# EAGLE design Laser_Teensy_No_AudShield (EAGLE 9.6.2)

## Sheet 1 of 3
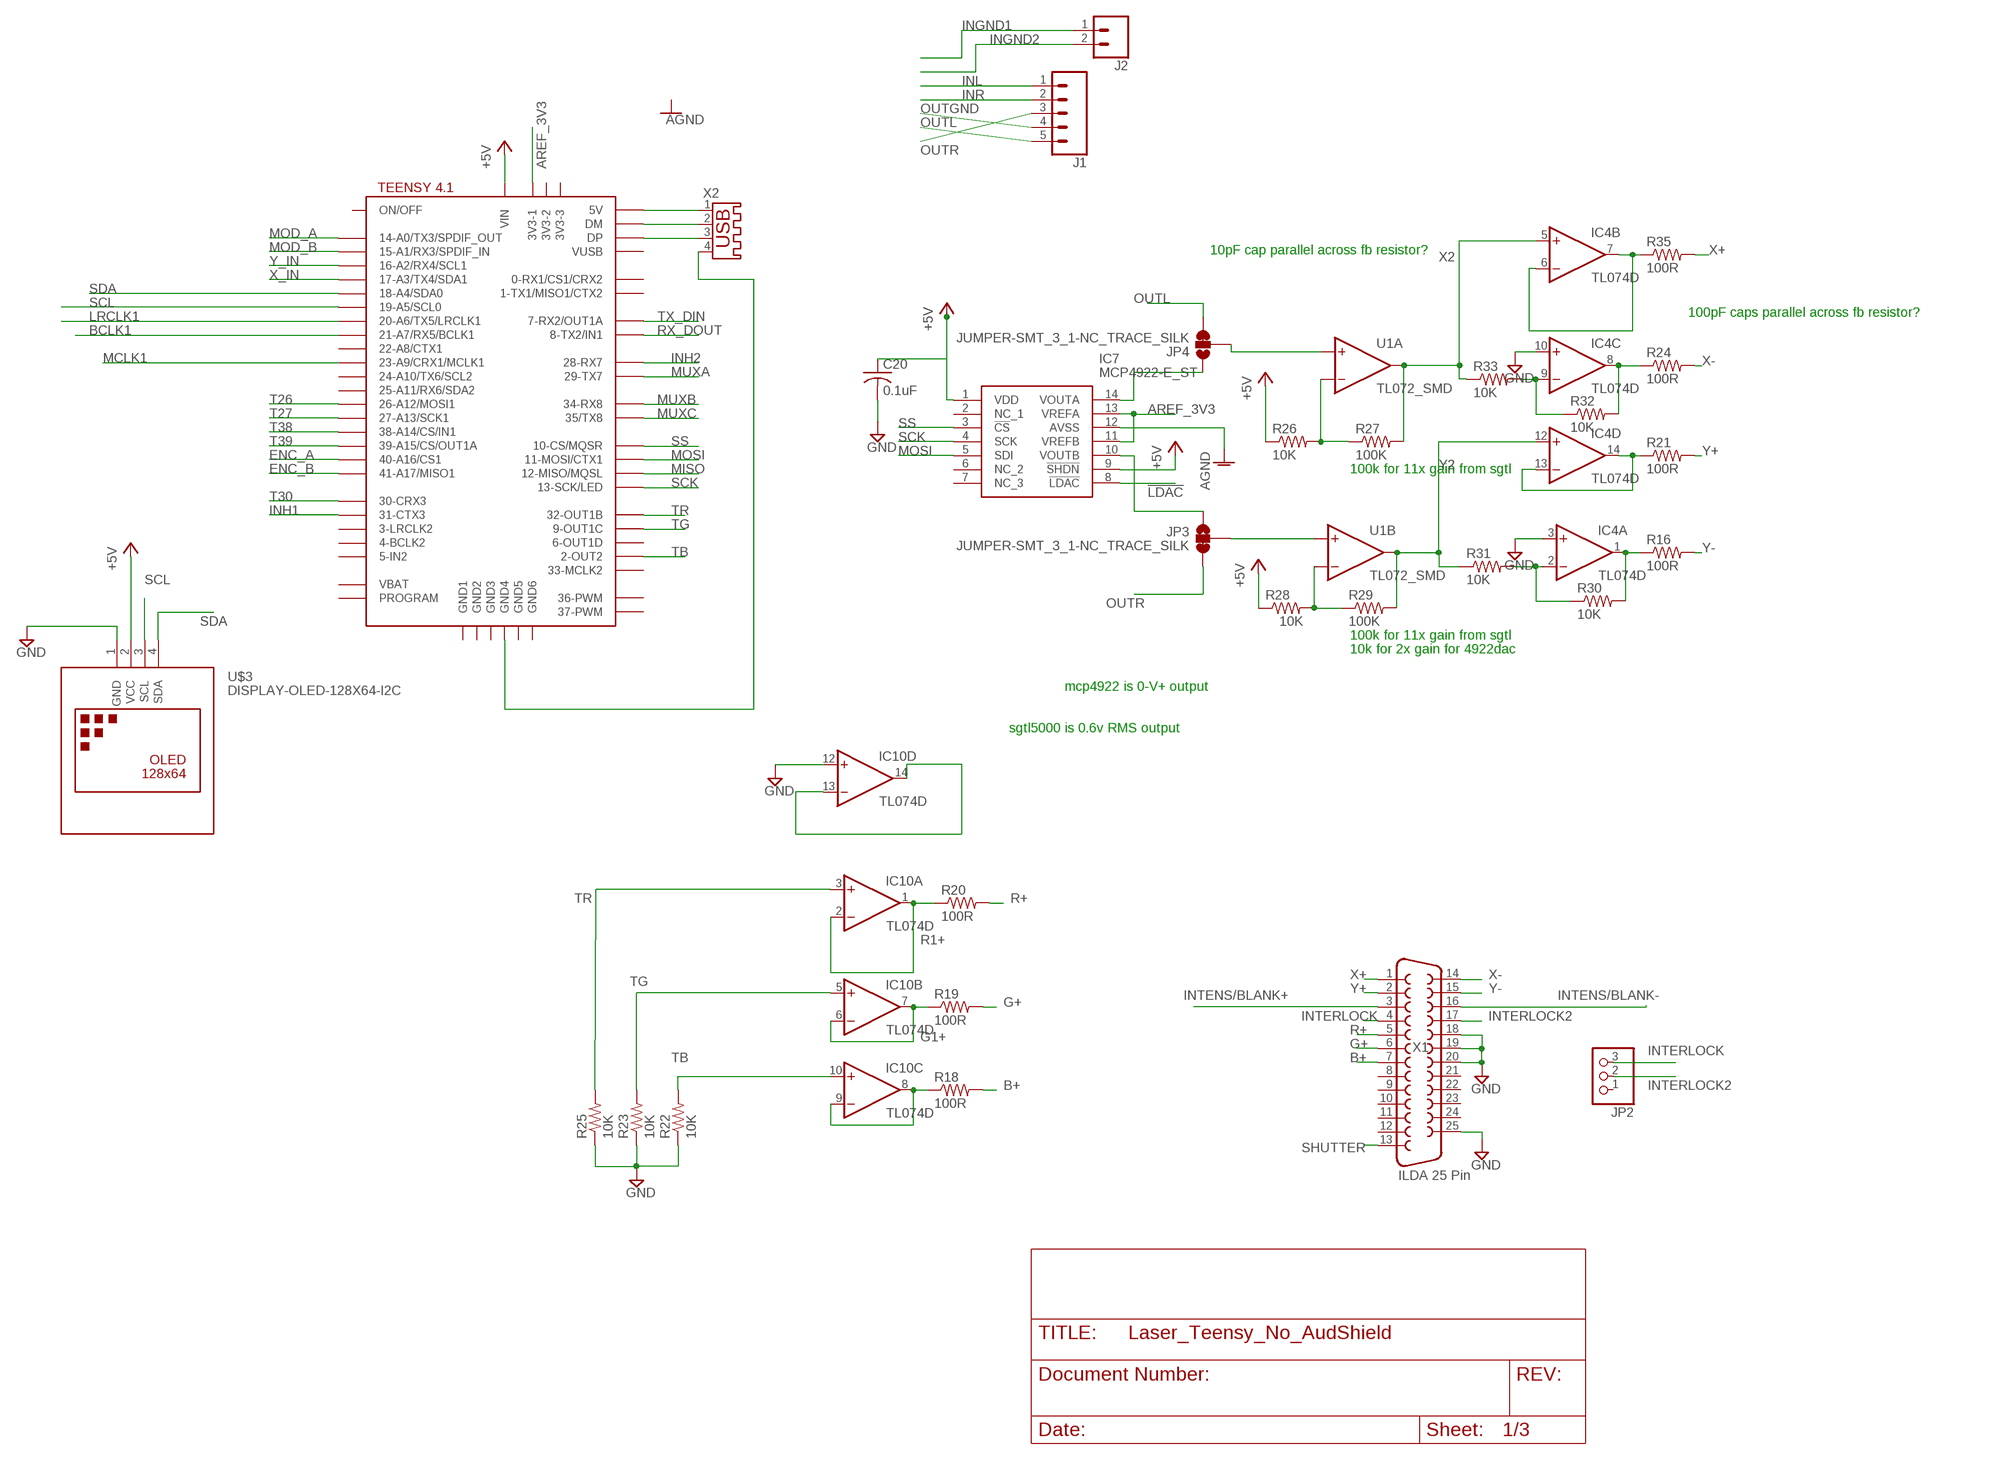
[diagram p0: schematic, sheet 1]

### Parts
C20  0.1uF  C-USC0603  [C0603]
IC4  TL074D  [SO14]
IC7  MCP4922-E_ST  [SOP65P638X110-14N]
IC10  TL074D  [SO14]
J1  CONN_05  [1X05]
J2  CONN_02  [1X02]
JP2  PINHD-1X3  [1X03]
JP3  JUMPER-SMT_3_1-NC_TRACE_SILK  [SMT-JUMPER_3_1-NC_TRACE_SILK]
JP4  JUMPER-SMT_3_1-NC_TRACE_SILK  [SMT-JUMPER_3_1-NC_TRACE_SILK]
R16  100R  R-US_R0603  [R0603]
R18  100R  R-US_R0603  [R0603]
R19  100R  R-US_R0603  [R0603]
R20  100R  R-US_R0603  [R0603]
R21  100R  R-US_R0603  [R0603]
R22  10K  R-US_R0603  [R0603]
R23  10K  R-US_R0603  [R0603]
R24  100R  R-US_R0603  [R0603]
R25  10K  R-US_R0603  [R0603]
R26  10K  R-US_R0603  [R0603]
R27  100K  R-US_R0603  [R0603]
R28  10K  R-US_R0603  [R0603]
R29  100K  R-US_R0603  [R0603]
R30  10K  R-US_R0603  [R0603]
R31  10K  R-US_R0603  [R0603]
R32  10K  R-US_R0603  [R0603]
R33  10K  R-US_R0603  [R0603]
R35  100R  R-US_R0603  [R0603]
U1  TL072_SMD  [SO08]
U$2  TEENSY41-E  [TENNSY41-E]
U$3  DISPLAY-OLED-128X64-I2C  [DISPLAY-OLED-128X64-I2C]
X1  ILDA 25 Pin  F25D  [F25D]
X2  USB-A003  [USB-A003]

### Nets
!LDAC: IC7.8(!LDAC)
+5V [power]: C20.1 IC7.1(VDD) IC7.9(!SHDN) R26.1 R28.1 U$2.VIN U$3.2(VCC) ; also sheet 2,3
AGND: IC7.12(AVSS)
AREF_3V3: IC7.11(VREFB) IC7.13(VREFA) U$2.3V3-1
B1+1: IC10.8(C:OUT) IC10.9(C:-IN) R18.1
B+: R18.2 X1.7
BCLK1: U$2.21-A7/RX5/BCLK1
ENC_A: U$2.40-A16/CS1 ; also sheet 2
ENC_B: U$2.41-A17/MISO1 ; also sheet 2
G1+: IC10.6(B:-IN) IC10.7(B:OUT) R19.1
G+: R19.2 X1.6
GND: C20.2 IC4.3(A:+IN) IC4.10(C:+IN) IC10.12(D:+IN) R22.1 R23.1 R25.1 U$3.1(GND) X1.18 X1.19 X1.20 X1.25 ; also sheet 2,3
INGND1: J2.1
INGND2: J2.2
INH1: U$2.31-CTX3 ; also sheet 2
INH2: U$2.28-RX7 ; also sheet 2
INL: J1.1
INR: J1.2
INTENS/BLANK+: X1.3
INTENS/BLANK-: X1.16
INTERLOCK: JP2.3 X1.4
INTERLOCK2: JP2.2 X1.17
LRCLK1: U$2.20-A6/TX5/LRCLK1
MCLK1: U$2.23-A9/CRX1/MCLK1
MISO: U$2.12-MISO/MQSL
MOD_A: U$2.14-A0/TX3/SPDIF_OUT ; also sheet 2
MOD_B: U$2.15-A1/RX3/SPDIF_IN ; also sheet 2
MOSI: IC7.5(SDI) U$2.11-MOSI/CTX1
MUXA: U$2.29-TX7 ; also sheet 2
MUXB: U$2.34-RX8 ; also sheet 2
MUXC: U$2.35-TX8(35/TX8) ; also sheet 2
N$1: IC7.14(VOUTA) JP4.1
N$2: IC7.10(VOUTB) JP3.1
N$3: U$2.+5V(5V) X2.1
N$4: U$2.DM X2.2
N$5: U$2.DP X2.3
N$12: U$2.GND4 X2.4
N$13: IC10.13(D:-IN) IC10.14(D:OUT)
N$17: JP3.2 U1.5(B:+IN)
N$18: JP4.2 U1.3(A:+IN)
N$30: R26.2 R27.1 U1.2(A:-IN)
N$31: R28.2 R29.1 U1.6(B:-IN)
N$35: IC4.9(C:-IN) R32.1 R33.2
N$36: IC4.2(A:-IN) R30.1 R31.2
OUTGND: J1.4
OUTL: J1.5 JP4.3
OUTR: J1.3 JP3.3
R1+: IC10.1(A:OUT) IC10.2(A:-IN) R20.1
R+: R20.2 X1.5
RX_DOUT: U$2.8-TX2/IN1
SCK: IC7.4(SCK) U$2.13-SCK/LED
SCL: U$2.19-A5/SCL0 U$3.3(SCL)
SDA: U$2.18-A4/SDA0 U$3.4(SDA)
SHUTTER: X1.13
SS: IC7.3(!CS) U$2.10-CS\MQSR(10-CS/MQSR)
T26: U$2.26-A12/MOSI1 ; also sheet 2
T27: U$2.27-A13/SCK1 ; also sheet 2
T30: U$2.30-CRX3
T38: U$2.38-A14/CS/IN1 ; also sheet 2
T39: U$2.39-A15/CS/OUT1A ; also sheet 2
TB: IC10.10(C:+IN) R22.2 U$2.2-OUT2
TG: IC10.5(B:+IN) R23.2 U$2.9-OUT1C
TR: IC10.3(A:+IN) R25.2 U$2.32-OUT1B
TX_DIN: U$2.7-RX2/OUT1A
X1+: IC4.6(B:-IN) IC4.7(B:OUT) R35.1
X1-: IC4.8(C:OUT) R24.1 R32.2
X2: IC4.5(B:+IN) R27.2 R33.1 U1.1(A:OUT)
X+: R35.2 X1.1
X-: R24.2 X1.14
X_IN: U$2.17-A3/TX4/SDA1 ; also sheet 2
Y1+: IC4.13(D:-IN) IC4.14(D:OUT) R21.1
Y1-: IC4.1(A:OUT) R16.1 R30.2
Y2: IC4.12(D:+IN) R29.2 R31.1 U1.7(B:OUT)
Y+: R21.2 X1.2
Y-: R16.2 X1.15
Y_IN: U$2.16-A2/RX4/SCL1 ; also sheet 2
Unconnected: IC7.2(NC_1) IC7.6(NC_2) IC7.7(NC_3) JP2.1 U$2.0-RX1/CS1/CRX2 U$2.1-TX1/MISO1/CTX2 U$2.3-LRCLK2 U$2.3V3-2 U$2.3V3-3 U$2.4-BCLK2 U$2.5-IN2 U$2.6-OUT1D U$2.22-A8/CTX1 U$2.24-A10/TX6/SCL2 U$2.25-A11/RX6/SDA2 U$2.33-MCLK2 U$2.36-PWM U$2.37-PWM U$2.GND1 U$2.GND2 U$2.GND3 U$2.GND5 U$2.GND6 U$2.ON/OFF U$2.PROGRAM U$2.VBAT U$2.VUSB X1.8 X1.9 X1.10 X1.11 X1.12 X1.21 X1.22 X1.23 X1.24

### Notes on the sheet
- 10pF cap parallel across fb resistor?
- 100pF caps parallel across fb resistor?
- 100k for 11x gain from sgtl
- 100k for 11x gain from sgtl
- 10k for 2x gain for 4922dac
- mcp4922 is 0-V+ output
- sgtl5000 is 0.6v RMS output

## Sheet 2 of 3
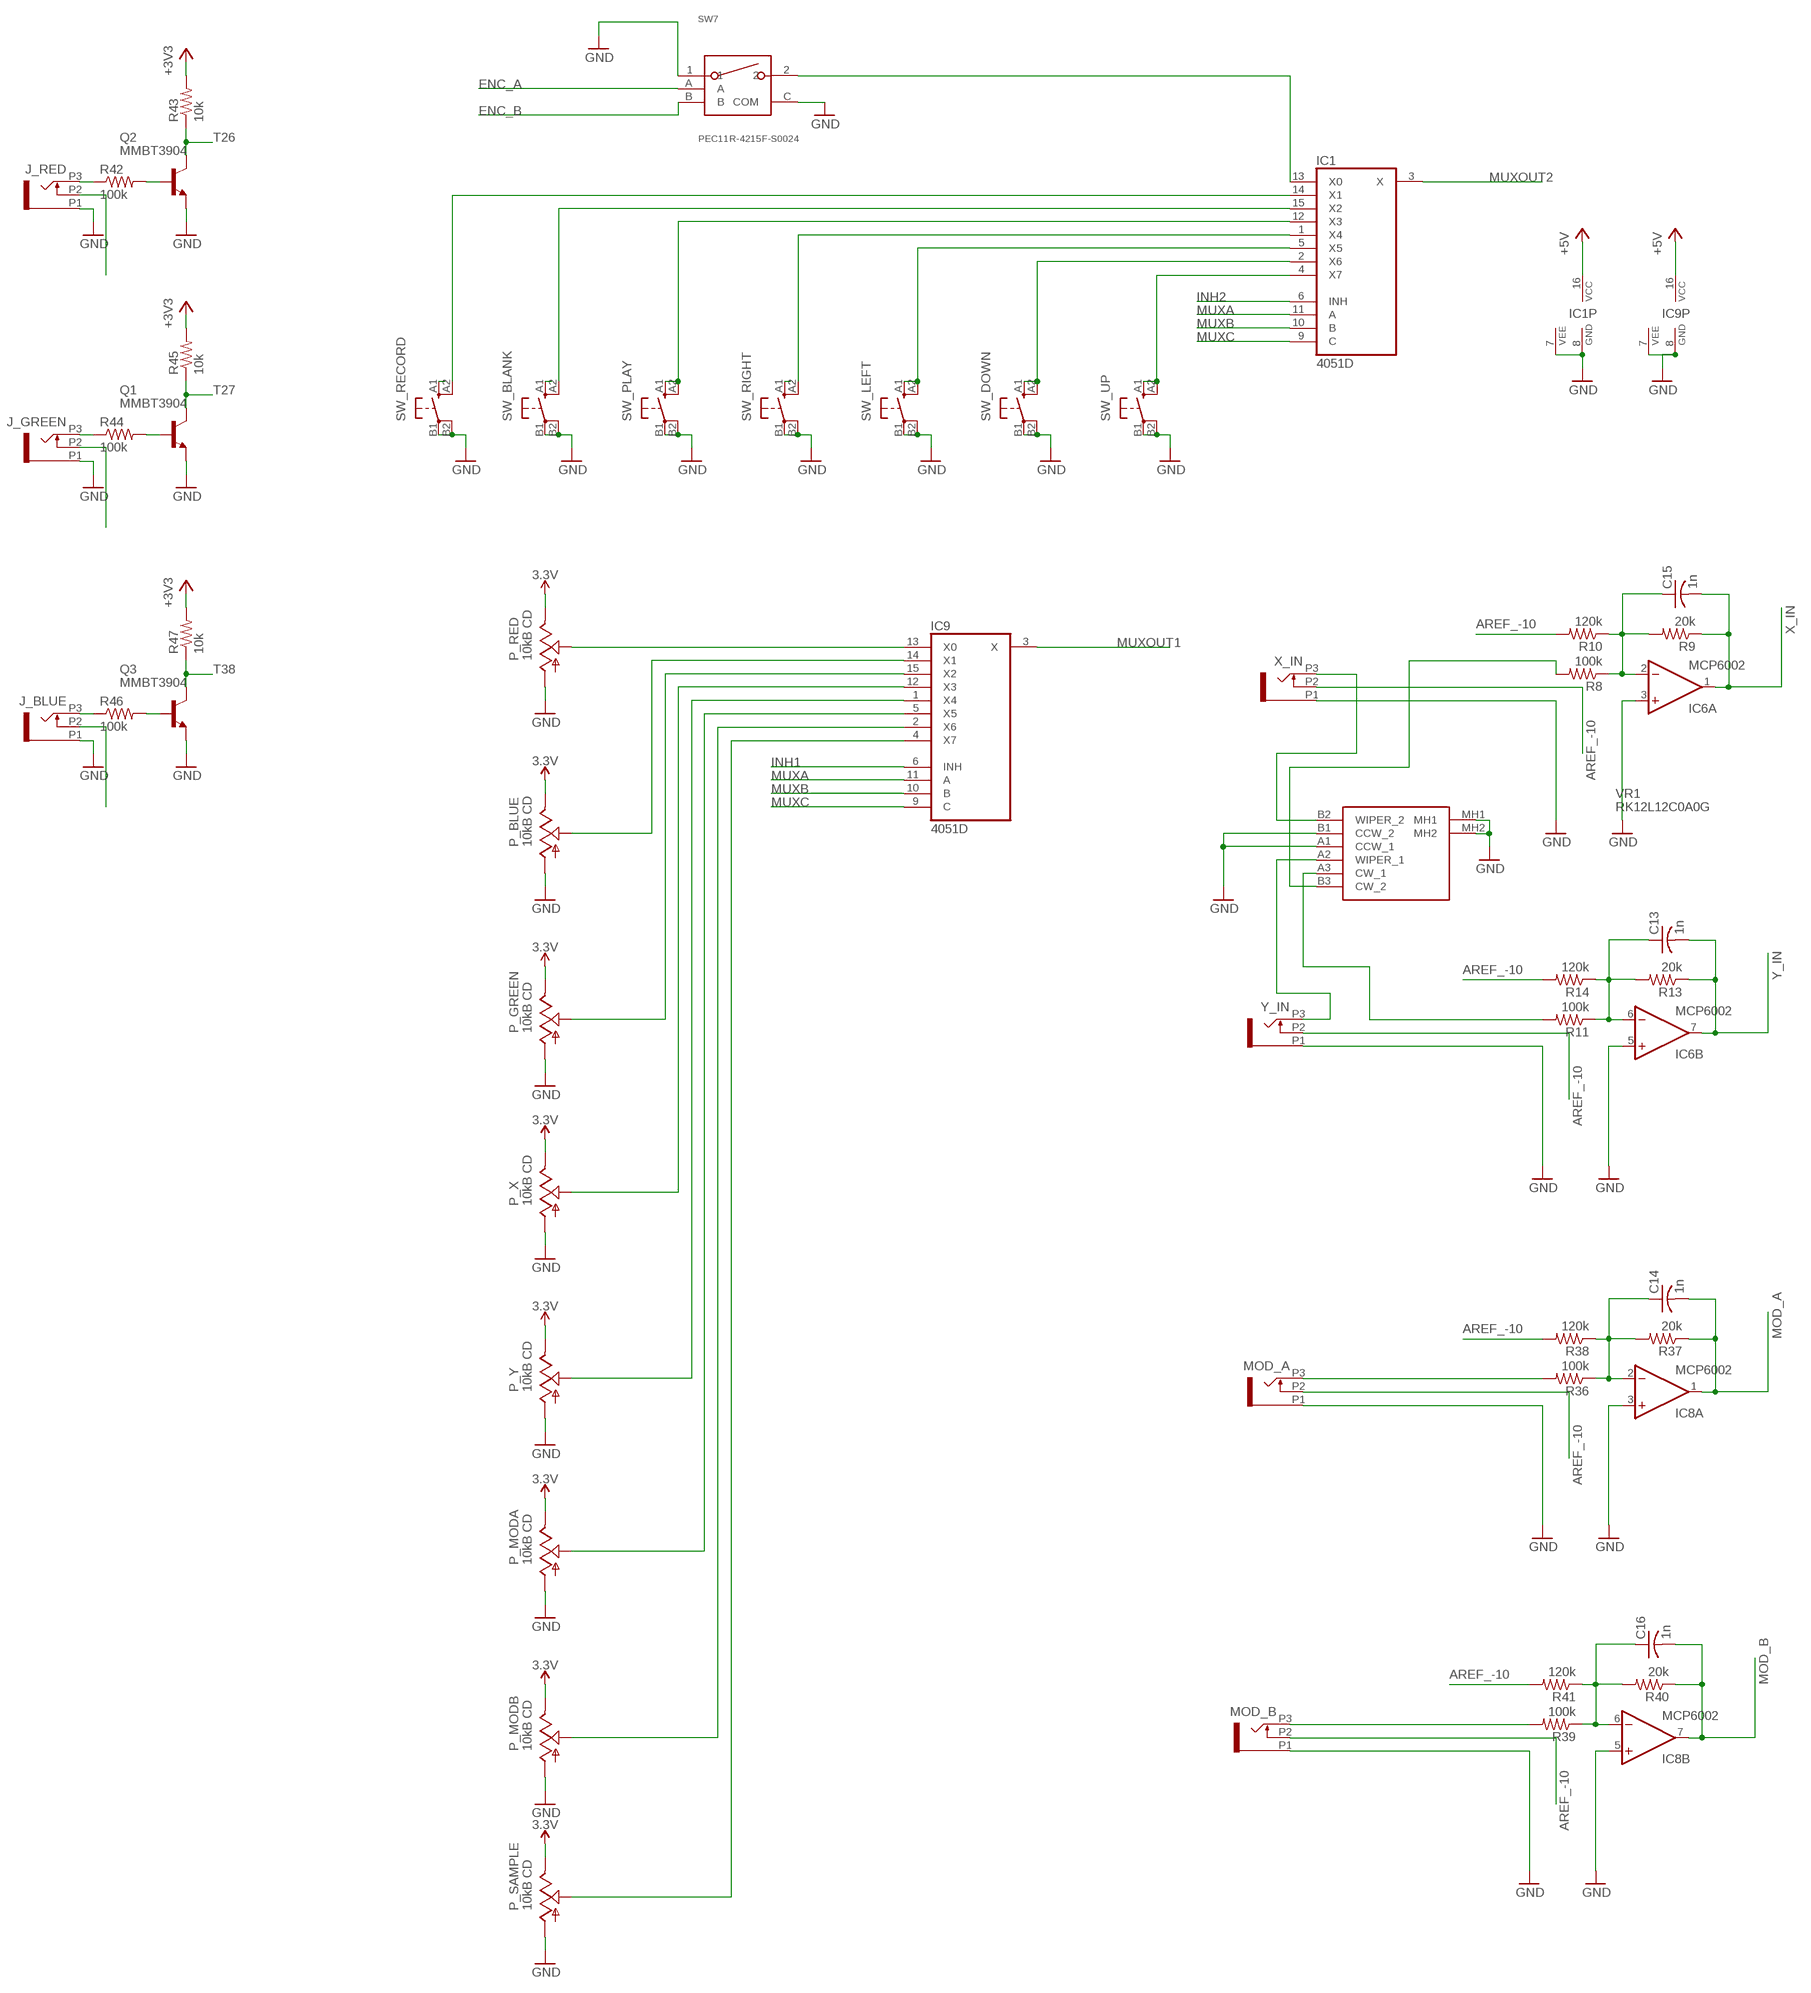
[diagram p1: schematic, sheet 2]

### Parts
C13  1n  C-US050-025X075  [C050-025X075]
C14  1n  C-US050-025X075  [C050-025X075]
C15  1n  C-US050-025X075  [C050-025X075]
C16  1n  C-US050-025X075  [C050-025X075]
IC1  4051D  [SO16]
IC6  MCP6002  TL072D  [SO08]
IC8  MCP6002  TL072D  [SO08]
IC9  4051D  [SO16]
J_BLUE  PJ301_THONKICONN6  [WQP_PJ_301M6]
J_GREEN  PJ301_THONKICONN6  [WQP_PJ_301M6]
J_RED  PJ301_THONKICONN6  [WQP_PJ_301M6]
MOD_A  PJ301_THONKICONN6  [WQP_PJ_301M6]
MOD_B  PJ301_THONKICONN6  [WQP_PJ_301M6]
P_BLUE  10kB CD  POT_USVERTICAL_PS  [ALPS_POT_VERTICAL_PS]
P_GREEN  10kB CD  POT_USVERTICAL_PS  [ALPS_POT_VERTICAL_PS]
P_MODA  10kB CD  POT_USVERTICAL_PS  [ALPS_POT_VERTICAL_PS]
P_MODB  10kB CD  POT_USVERTICAL_PS  [ALPS_POT_VERTICAL_PS]
P_RED  10kB CD  POT_USVERTICAL_PS  [ALPS_POT_VERTICAL_PS]
P_SAMPLE  10kB CD  POT_USVERTICAL_PS  [ALPS_POT_VERTICAL_PS]
P_X  10kB CD  POT_USVERTICAL_PS  [ALPS_POT_VERTICAL_PS]
P_Y  10kB CD  POT_USVERTICAL_PS  [ALPS_POT_VERTICAL_PS]
Q1  MMBT3904  MMBT3904LT1-NPN-SOT23-BEC  [SOT23-BEC]
Q2  MMBT3904  MMBT3904LT1-NPN-SOT23-BEC  [SOT23-BEC]
Q3  MMBT3904  MMBT3904LT1-NPN-SOT23-BEC  [SOT23-BEC]
R8  100k  R-US_0204/7  [0204/7]
R9  20k  R-US_0204/7  [0204/7]
R10  120k  R-US_0204/7  [0204/7]
R11  100k  R-US_0204/7  [0204/7]
R13  20k  R-US_0204/7  [0204/7]
R14  120k  R-US_0204/7  [0204/7]
R36  100k  R-US_0204/7  [0204/7]
R37  20k  R-US_0204/7  [0204/7]
R38  120k  R-US_0204/7  [0204/7]
R39  100k  R-US_0204/7  [0204/7]
R40  20k  R-US_0204/7  [0204/7]
R41  120k  R-US_0204/7  [0204/7]
R42  100k  R-US_R0603  [R0603]
R43  10k  R-US_R0603  [R0603]
R44  100k  R-US_R0603  [R0603]
R45  10k  R-US_R0603  [R0603]
R46  100k  R-US_R0603  [R0603]
R47  10k  R-US_R0603  [R0603]
SW7  PEC11R-4215F-S0024  [PEC11R-4215F-S0024]
SW_BLANK  D6R  [D6R]
SW_DOWN  D6R  [D6R]
SW_LEFT  D6R  [D6R]
SW_PLAY  D6R  [D6R]
SW_RECORD  D6R  [D6R]
SW_RIGHT  D6R  [D6R]
SW_UP  D6R  [D6R]
VR1  RK12L12C0A0G  [RK12L12C0A0G]
X_IN  PJ301_THONKICONN6  [WQP_PJ_301M6]
Y_IN  PJ301_THONKICONN6  [WQP_PJ_301M6]

### Nets
3.3V [+3V3]: P_BLUE.P$1(E) P_GREEN.P$1(E) P_MODA.P$1(E) P_MODB.P$1(E) P_RED.P$1(E) P_SAMPLE.P$1(E) P_X.P$1(E) P_Y.P$1(E)
+3V3: R43.2 R45.2 R47.2 ; also sheet 3
+5V [power]: IC1.16(VCC) IC9.16(VCC) ; also sheet 1,3
AREF_-10 [-10V]: MOD_A.P2 MOD_B.P2 R10.2 R14.2 R38.2 R41.2 X_IN.P2 Y_IN.P2 ; also sheet 3
ENC_A: SW7.A ; also sheet 1
ENC_B: SW7.B ; also sheet 1
GND: IC1.7(VEE) IC1.8(GND) IC6.3(A:+IN) IC6.5(B:+IN) IC8.3(A:+IN) IC8.5(B:+IN) IC9.7(VEE) IC9.8(GND) J_BLUE.P1 J_GREEN.P1 J_RED.P1 MOD_A.P1 MOD_B.P1 P_BLUE.P$3(A) P_GREEN.P$3(A) P_MODA.P$3(A) P_MODB.P$3(A) P_RED.P$3(A) P_SAMPLE.P$3(A) P_X.P$3(A) P_Y.P$3(A) Q1.E Q2.E Q3.E SW7.1 SW7.C(COM) SW_BLANK.B2(P1) SW_DOWN.B1(P) SW_DOWN.B2(P1) SW_LEFT.B1(P) SW_LEFT.B2(P1) SW_PLAY.B1(P) SW_PLAY.B2(P1) SW_RECORD.B2(P1) SW_RIGHT.B2(P1) SW_UP.B1(P) SW_UP.B2(P1) VR1.A1(CCW_1) VR1.B1(CCW_2) VR1.MH1 VR1.MH2 X_IN.P1 Y_IN.P1 ; also sheet 1,3
INH1: IC9.6(INH) ; also sheet 1
INH2: IC1.6(INH) ; also sheet 1
MOD_A: C14.2 IC8.1(A:OUT) R37.1 ; also sheet 1
MOD_B: C16.2 IC8.7(B:OUT) R40.1 ; also sheet 1
MUXA: IC1.11(A) IC9.11(A) ; also sheet 1
MUXB: IC1.10(B) IC9.10(B) ; also sheet 1
MUXC: IC1.9(C) IC9.9(C) ; also sheet 1
MUXOUT1: IC9.3(X)
MUXOUT2: IC1.3(X)
N$6: C15.1 IC6.2(A:-IN) R8.1 R9.2 R10.1
N$9: VR1.B2(WIPER_2) X_IN.P3
N$11: C13.1 IC6.6(B:-IN) R11.1 R13.2 R14.1
N$14: C14.1 IC8.2(A:-IN) R36.1 R37.2 R38.1
N$15: R8.2 VR1.B3(CW_2)
N$19: SW_BLANK.A1(S)
N$21: SW_BLANK.B1(P)
N$22: IC9.13(X0) P_RED.P$2(S)
N$23: SW_RIGHT.B1(P)
N$24: IC9.14(X1) P_BLUE.P$2(S)
N$25: VR1.A2(WIPER_1) Y_IN.P3
N$26: IC1.1(X4) SW_RIGHT.A2(S1)
N$27: IC9.15(X2) P_GREEN.P$2(S)
N$28: IC1.15(X2) SW_BLANK.A2(S1)
N$29: IC9.12(X3) P_X.P$2(S)
N$32: IC9.1(X4) P_Y.P$2(S)
N$33: SW_RECORD.B1(P)
N$34: C16.1 IC8.6(B:-IN) R39.1 R40.2 R41.1
N$37: SW_RECORD.A1(S)
N$38: IC1.14(X1) SW_RECORD.A2(S1)
N$39: IC1.13(X0) SW7.2
N$40: IC9.5(X5) P_MODA.P$2(S)
N$41: IC9.2(X6) P_MODB.P$2(S)
N$42: IC9.4(X7) P_SAMPLE.P$2(S)
N$43: R11.2 VR1.A3(CW_1)
N$44: J_RED.P3 R42.1
N$45: MOD_A.P3 R36.2
N$46: MOD_B.P3 R39.2
N$47: J_RED.P2
N$48: Q1.B R44.2
N$49: J_GREEN.P3 R44.1
N$50: J_GREEN.P2
N$51: Q3.B R46.2
N$52: J_BLUE.P3 R46.1
N$53: J_BLUE.P2
N$66: Q2.B R42.2
T26: Q2.C R43.1 ; also sheet 1
T27: Q1.C R45.1 ; also sheet 1
T38: IC1.2(X6) IC1.12(X3) Q3.C R47.1 SW_DOWN.A1(S) SW_DOWN.A2(S1) SW_PLAY.A1(S) SW_PLAY.A2(S1) ; also sheet 1
T39: IC1.4(X7) IC1.5(X5) SW_LEFT.A1(S) SW_LEFT.A2(S1) SW_RIGHT.A1(S) SW_UP.A1(S) SW_UP.A2(S1) ; also sheet 1
X_IN: C15.2 IC6.1(A:OUT) R9.1 ; also sheet 1
Y_IN: C13.2 IC6.7(B:OUT) R13.1 ; also sheet 1

## Sheet 3 of 3
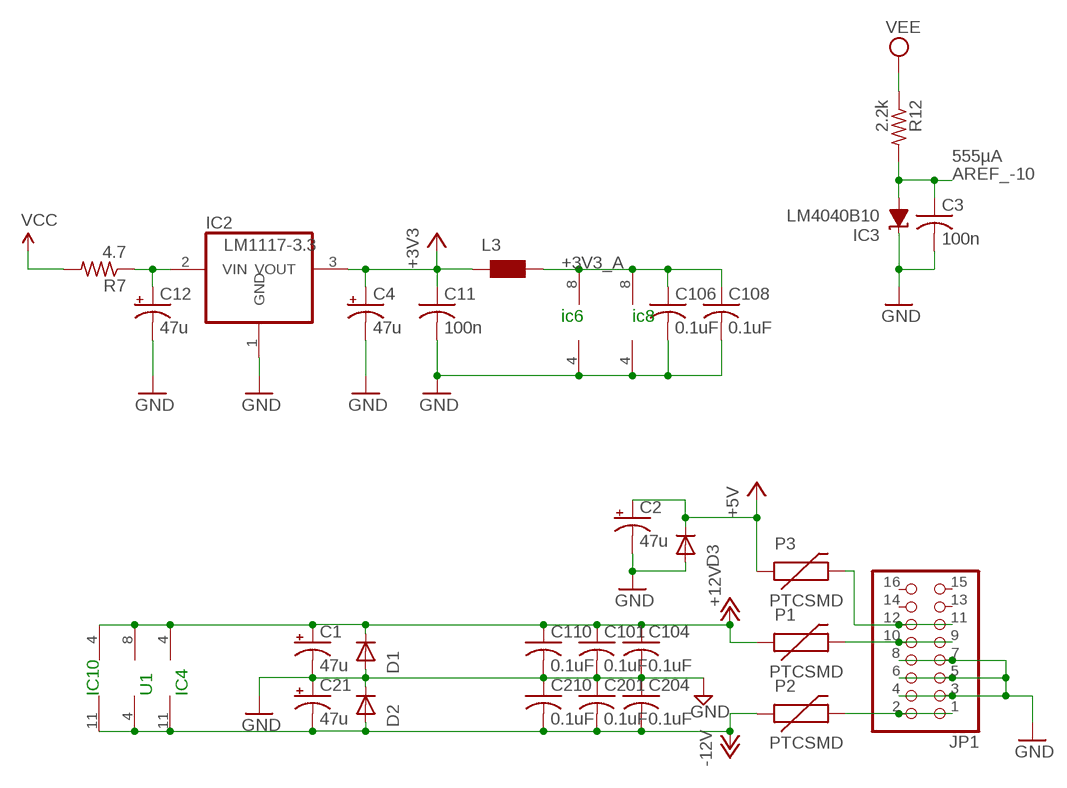
[diagram p2: schematic, sheet 3]

### Parts
C1  47u  CPOL-USD  [PANASONIC_D]
C2  47u  CPOL-USD  [PANASONIC_D]
C3  100n  C-USC0603  [C0603]
C4  47u  CPOL-USD  [PANASONIC_D]
C11  100n  C-USC0603  [C0603]
C12  47u  CPOL-USD  [PANASONIC_D]
C21  47u  CPOL-USD  [PANASONIC_D]
C101  0.1uF  C-USC0603  [C0603]
C104  0.1uF  C-USC0603  [C0603]
C106  0.1uF  C-USC0603  [C0603]
C108  0.1uF  C-USC0603  [C0603]
C110  0.1uF  C-USC0603  [C0603]
C201  0.1uF  C-USC0603  [C0603]
C204  0.1uF  C-USC0603  [C0603]
C210  0.1uF  C-USC0603  [C0603]
D1  1N5819HW  DIODE-SOD123  [SOD123]
D2  1N5819HW  DIODE-SOD123  [SOD123]
D3  1N5819HW  DIODE-SOD123  [SOD123]
IC2  LM1117-3.3  REG1117T  [TO252]
IC3  LM4040B10  LM4041B12DBZ  [DBZ_R-PDSO-G3]
JP1  PINHD-2X8  [2X08]
L3  WE-CBF_0603  [0603]
P1  PTCSMD  [PTC-1206]
P2  PTCSMD  [PTC-1206]
P3  PTCSMD  [PTC-1206]
R7  4.7  R-US_R1206  [R1206]
R12  2.2k  R-US_R0603  [R0603]

### Nets
+3V3: C4.+ C11.1 IC2.3(VOUT) L3.1 ; also sheet 2
+3V3_A: C106.1 C108.1 IC6.8(P:V+) IC8.8(P:V+) L3.2
+5V [power]: C2.+ D3.C P3.1 ; also sheet 1,2
+12V [power]: C1.+ C101.1 C104.1 C110.1 D1.C IC4.4(P:V+) IC10.4(P:V+) P1.1 U1.8(P:V+)
-12V [power]: C21.- C201.2 C204.2 C210.2 D2.A IC4.11(P:V-) IC10.11(P:V-) P2.1 U1.4(P:V-)
AREF_-10 [-10V]: C3.1 IC3.2(A) R12.2 ; also sheet 2
GND: C1.- C2.- C3.2 C4.- C11.2 C12.- C21.+ C101.2 C104.2 C106.2 C108.2 C110.2 C201.1 C204.1 C210.1 D1.A D2.C D3.A IC2.1(GND) IC3.1(C) IC6.4(P:V-) IC8.4(P:V-) JP1.3 JP1.4 JP1.5 JP1.6 JP1.7 JP1.8 ; also sheet 1,2
N$7: JP1.1 JP1.2 P2.2
N$8: JP1.9 JP1.10 P1.2
N$10: JP1.11 JP1.12 P3.2
N$16: C12.+ IC2.2(VIN) R7.1
VCC [VCC]: R7.2
VEE: R12.1
Unconnected: JP1.13 JP1.14 JP1.15 JP1.16

### Notes on the sheet
- 555µA
- ic6 | ic8
- IC10 | U1 | IC4

## Library data of the parts
C1 C2 C4 C12 C21 = rcl:CPOL-US: POLARIZED CAPACITOR, American symbol
C3 C11 = rcl:C-US: CAPACITOR, American symbol
C13-C16 = rcl:C-US: CAPACITOR, American symbol; SPICEPREFIX: C
C20 C101 C104 C106 C108 C110 C201 C204 C210 = adafruit:C-US: CAPACITOR, American symbol
D1-D3 = diode:DIODE-: DIODE
IC1 IC9 = 40xx:4051: 8-channel ANALOG MULTIPLEXER
IC2 = og-vreg:REG1117: 800mA and 1A Low Dropout (LDO) Positive Regulator 1.8V, 2.5V, 2.85V, 3.3V, 5V, and Adj
IC3 = texas:LM4041: PRECISION MICROPOWER SHUNT VOLTAGE REFERENCE Source: http://focus.ti.com/lit/ds/slcs146e/slcs146e.pdf
IC4 IC10 = linear:TL074: OP AMP
IC6 IC8 = linear:TL072: OP AMP
IC7 = SamacSys_Parts:MCP4922-E_ST: Microchip MCP4922-E/ST, 2-channel 12 bit Serial DAC, 14-Pin TSSOP Source: Datasheet <http://componentsearchengine.com/Datasheets/3/MCP4922-E_ST.pdf>; ARROW_PART_NUMBER: MCP4922-E/ST; ARROW_PRICE-STOCK: https://www.arrow.com/en/products/mcp4922-est/microchip-technology; DESCRIPTION: Microchip MCP4922-E/ST, 2-channel 12 bit Serial DAC, 14-Pin TSSOP; HEIGHT: 1.1mm; MANUFACTURER_NAME: Microchip; MANUFACTURER_PART_NUMBER: MCP4922-E/ST; MOUSER_PART_NUMBER: 579-MCP4922-E/ST; MOUSER_PRICE-STOCK: https://www.mouser.co.uk/ProductDetail/Microchip-Technology/MCP4922-E-ST?qs=iRhCjdSJZe6gRerFwLixKQ%3D%3D
J1 = SparkFun-Connectors:CONN_05: Multi connection point. Often used as Generic Header-pin footprint for 0.1 inch spaced/style header connections On any of the 0.1 inch spaced packages, you can populate with these: Break Away Headers - Straight <https://www.sparkfun.com/products/116> (PRT-00116) Break Away Male Headers - Right Angle <https://www.sparkfun.com/products/553> (PRT-00553) Female Headers <https://www.sparkfun.com/products/115> (PRT-00115) Break Away Headers - Machine Pin <https://www.sparkfun.com/products/117> (PRT-00117) Break Away Female Headers - Swiss Machine Pin <https://www.sparkfun.com/products/743> (PRT-00743) For SCREWTERMINALS and SPRING TERMINALS visit here: Screw Terimnals on SparkFun.com <https://www.sparkfun.com/search/results?term=Screw+Terminals> (5mm/3.5mm/2.54mm spacing) This device is also useful as a general connection point to wire up your design to another part of your project. Our various solder wires solder well into these plated through hole pads. Hook-Up Wire - Assortment (Stranded, 22 AWG) <https://www.sparkfun.com/products/11375> (PRT-11375) Hook-Up Wire - Assortment (Solid Core, 22 AWG) <https://www.sparkfun.com/products/11367> (PRT-11367) View the entire wire category on our website here <https://www.sparkfun.com/categories/141> Special notes: Molex polarized connector foot print use with SKU : PRT-08231 with associated crimp pins and housings. 1MM SMD Version SKU: PRT-10208
J2 = SparkFun-Connectors:CONN_02: Multi connection point. Often used as Generic Header-pin footprint for 0.1 inch spaced/style header connections On any of the 0.1 inch spaced packages, you can populate with these: Break Away Headers - Straight <https://www.sparkfun.com/products/116> (PRT-00116) Break Away Male Headers - Right Angle <https://www.sparkfun.com/products/553> (PRT-00553) Female Headers <https://www.sparkfun.com/products/115> (PRT-00115) Break Away Headers - Machine Pin <https://www.sparkfun.com/products/117> (PRT-00117) Break Away Female Headers - Swiss Machine Pin <https://www.sparkfun.com/products/743> (PRT-00743) For SCREWTERMINALS and SPRING TERMINALS visit here: Screw Terimnals on SparkFun.com <https://www.sparkfun.com/search/results?term=Screw+Terminals> (5mm/3.5mm/2.54mm spacing) This device is also useful as a general connection point to wire up your design to another part of your project. Our various solder wires solder well into these plated through hole pads. Hook-Up Wire - Assortment (Stranded, 22 AWG) <https://www.sparkfun.com/products/11375> (PRT-11375) Hook-Up Wire - Assortment (Solid Core, 22 AWG) <https://www.sparkfun.com/products/11367> (PRT-11367) View the entire wire category on our website here <https://www.sparkfun.com/categories/141> Special notes: Molex polarized connector foot print use with: PRT-08233 with associated crimp pins and housings. 2.54_SCREWTERM for use with PRT-10571. 3.5mm Screw Terminal footprints for PRT-08084 5mm Screw Terminal footprints for use with PRT-08432
J_BLUE J_GREEN J_RED = og-pj301:PJ301_THONKICONN
JP1 = pinhead:PINHD-2X8: PIN HEADER
JP2 = pinhead:PINHD-1X3: PIN HEADER
JP3 JP4 = SparkFun-Jumpers:JUMPER-SMT_3_1-NC_TRACE: Normally closed trace jumper (1 of 2 connections) This jumper has a trace between two pads so it's normally closed (NC). The other connection is normally open (NO). Use a razor knife to open the connection. For best results follow the IPC guidelines for cutting traces: Cutout at least 0.063 mm (0.005 in). Remove all loose material to clean up the cut area. Seal the cut with an approved epoxy. Reapply solder to reclose the connection, or to close the NO connection.
L3 = wuerth-elektronik:WE-CBF: SMD EMI Suppression Ferrite Beads - excellent anti-EMI properties - low DCR - impedances till 3000 ohms - rated current up to 6 A
MOD_A MOD_B X_IN Y_IN = og-pj301_variations:PJ301_THONKICONN
P1-P3 = SparkFun:PTC: Resettable Fuse PTC Resettable Fuse. Spark Fun Electronics SKU : COM-08357
P_BLUE P_GREEN P_MODA P_MODB P_RED P_SAMPLE P_X P_Y = pot-alps:POT_US
Q1-Q3 = transistor:*-NPN-: NPN Transistror BF959 corrected 2008.03.06
R7 R12 R42-R47 = rcl:R-US_: RESISTOR, American symbol
R8-R11 R13 R14 R36-R41 = rcl:R-US_: RESISTOR, American symbol; SPICEPREFIX: R
R16 R18-R33 R35 = resistor:R-US_: RESISTOR, American symbol
SW7 = Switch:PEC11R-4215F-S0024: ROTARY ENCODER MECHANICAL 24PPR Manufacturer's datasheet <https://www.bourns.com/docs/Product-Datasheets/PEC11R.pdf>; CREATED_BY: PCBLayout.com; DIGIKEY_PART_NUMBER: PEC11R-4215F-S0024-ND; MANUFACTURER: Bourns Inc.; MPN: PEC11R-4215F-S0024
SW_BLANK SW_DOWN SW_LEFT SW_PLAY SW_RECORD SW_RIGHT SW_UP = og-switch:D6R: C&K D6R
U1 = MusicThingModular:TL072: Generic Dual Op Amp
U$2 = teensy:TEENSY41-E
U$3 = diy-modules:DISPLAY-OLED-128X64-I2C: 128x64 Dot Matrix OLED Module based on SSD1306 chip Variant with I2C interface More details available here: http://www.instructables.com/id/Monochrome-096-i2c-OLED-display-with-arduino-SSD13/ SSD1306 datasheet: https://cdn-shop.adafruit.com/datasheets/SSD1306.pdf Click here to find device on ebay.com <http://www.ebay.com/sch/oled+display+128x64+iic> Note: There are two variants: I2C and SPI. Search for the proper version.
VR1 = SamacSys_Parts:RK12L12C0A0G: Alps Potentiometer RK12L Series with a 6 mm Dia. Shaft 10k +/-20%, Logarithmic, Through Hole Source: Datasheet <http://uk.rs-online.com/web/p/products/7293697P>; DESCRIPTION: Alps Potentiometer RK12L Series with a 6 mm Dia. Shaft 10k +/-20%, Logarithmic, Through Hole; HEIGHT: 15mm; MANUFACTURER_NAME: ALPS; MANUFACTURER_PART_NUMBER: RK12L12C0A0G; MOUSER_PART_NUMBER: 688-RK12L12C0A0G; MOUSER_PRICE-STOCK: https://www.mouser.co.uk/ProductDetail/ALPS/RK12L12C0A0G?qs=haWY0xvQGj%2FMhz6JhOHy%252BQ%3D%3D
X1 = SparkFun:F25: D-SUB 25 25 Pin male connector. PCB edge mount for regular PCB thicknesses. This connector will connect directly to the back of a PC parallel port or through a normal DB25 extension cable (M/F). SKU: PRT-08287
X2 = con-yamaichi:USB-A003: USB connector; OC_FARNELL: unknown; OC_NEWARK: unknown

## Net classes
1 power: width 0.305 mm, clearance 0.203 mm
2 +3V3: width 0.356 mm, clearance 0.152 mm to class 0, clearance 0.254 mm
3 -10V: width 0.356 mm, clearance 0.152 mm to class 0, clearance 0.254 mm
4 VCC: width 0.457 mm, clearance 0.152 mm to class 0, clearance 0.254 mm

## Board
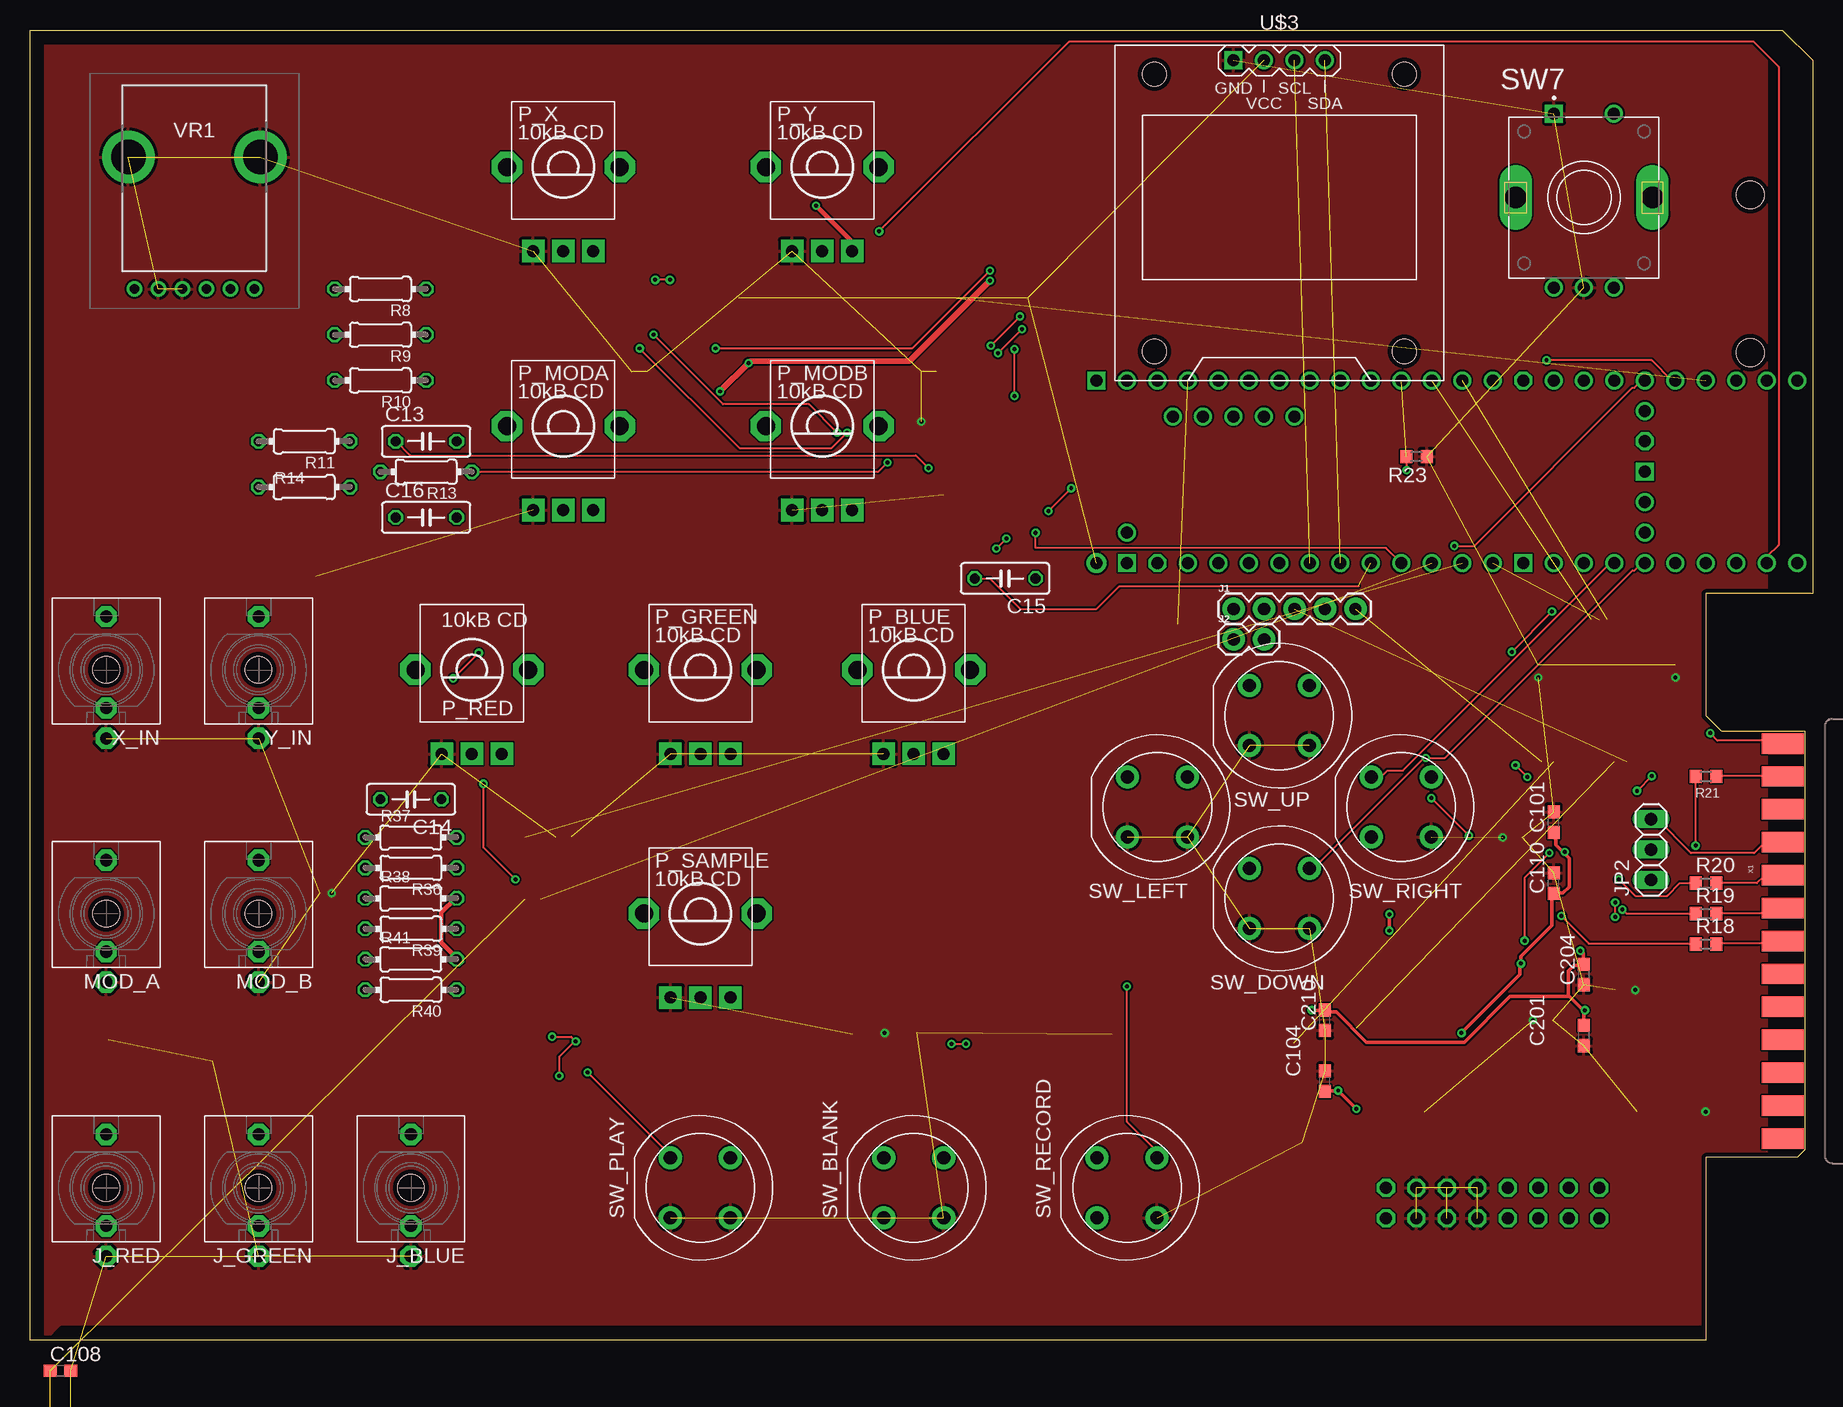
[diagram p3: board, top side]
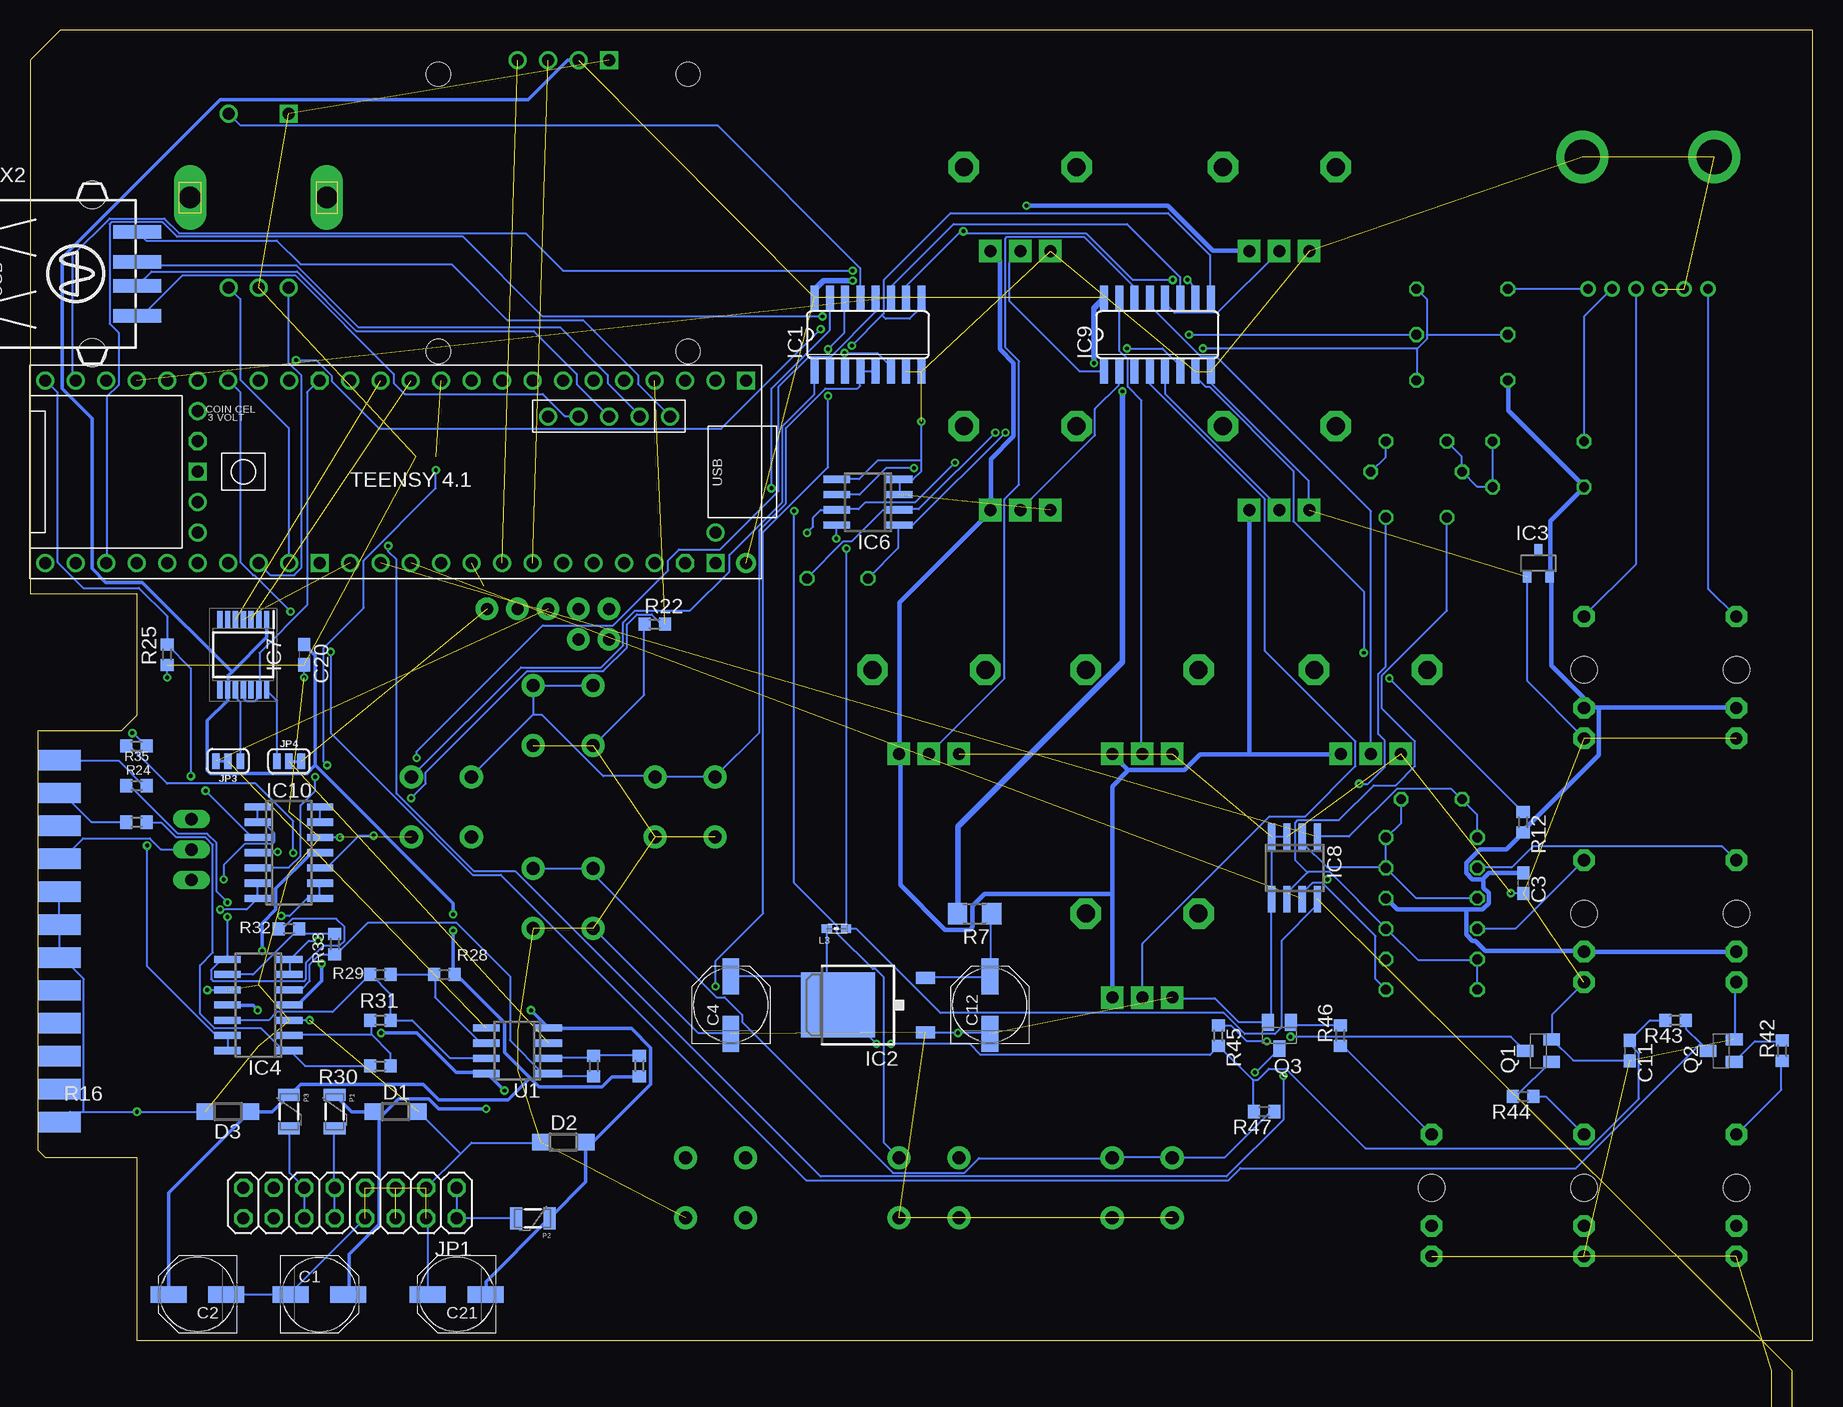
[diagram p4: board, bottom side, seen from below]

Size 148.59 x 109.22 mm. Coordinates in mm from the lower left corner, seen from the top.
Outline: 0,0 0,109.22 146.05,109.22 148.59,106.68 148.59,62.23 139.7,62.23 139.7,52.07 140.97,50.8 147.95,50.8 147.95,15.88 147.32,15.24 139.7,15.24 139.7,0 0,0
Copper layers (1*16): Top 0.0356mm / dielectric 1.5011mm / Bottom 0.0356mm
Design rules "LaenPCBOrder": minimum track width 6mil, minimum drill 13mil, track to track 6mil, track to pad 6mil, pad to pad 6mil, via to via 6mil, smd to smd 6mil, copper to edge 15mil, drill to drill 6mil, minimum pad ring 7mil, minimum via ring 7mil, stop-mask expansion 4mil, vias tented up to drill 0mil, thermal gap 10mil

### Footprints (pad centres in the part's own frame; a part is rotated, then mirrored left to right if it is on the bottom)
PANASONIC_D = smd 3 x 1.4: + 2.4,0; - -2.4,0
C0603 = smd 1.1 x 1: 1 -0.85,0; 2 0.85,0
C050-025X075 = drill 0.813 octagon: 1 -2.54,0; 2 2.54,0
SOD123 = smd 1.4 x 1.4: A 1.9,0; C -1.9,0
SO16 = smd 0.66 x 2.032: 1 -4.445,-3.073; 2 -3.175,-3.073; 3 -1.905,-3.073; 4 -0.635,-3.073; 5 0.635,-3.073; 6 1.905,-3.073; 7 3.175,-3.073; 8 4.445,-3.073; 9 4.445,3.073; 10 3.175,3.073; 11 1.905,3.073; 12 0.635,3.073; 13 -0.635,3.073; 14 -1.905,3.073; 15 -3.175,3.073; 16 -4.445,3.073
TO252 = smd 1 x 1.6: 1 -2.28,-4.8; 2 2.28,-4.8 | smd 5.4 x 6.2: 3 0,2.5
DBZ_R-PDSO-G3 = smd 0.7 x 1: 1 -0.95,-1.1; 2 0.95,-1.1; 3 0,1.1
SO14 = smd 0.6 x 2.2: 1 -3.81,-2.6; 2 -2.54,-2.6; 3 -1.27,-2.6; 4 0,-2.6; 5 1.27,-2.6; 6 2.54,-2.6; 7 3.81,-2.6; 8 3.81,2.6; 9 2.54,2.6; 10 1.27,2.6; 11 0,2.6; 12 -1.27,2.6; 13 -2.54,2.6; 14 -3.81,2.6
SO08 = smd 0.6 x 2.2: 1 -1.905,-2.6; 2 -0.635,-2.6; 3 0.635,-2.6; 4 1.905,-2.6; 5 1.905,2.6; 6 0.635,2.6; 7 -0.635,2.6; 8 -1.905,2.6
SOP65P638X110-14N = smd 1.45 x 0.45: 1 -2.925,1.95; 2 -2.925,1.3; 3 -2.925,0.65; 4 -2.925,0; 5 -2.925,-0.65; 6 -2.925,-1.3; 7 -2.925,-1.95; 8 2.925,-1.95; 9 2.925,-1.3; 10 2.925,-0.65; 11 2.925,0; 12 2.925,0.65; 13 2.925,1.3; 14 2.925,1.95
1X05 = drill 1.016 pad 1.88: 1 0,0; 2 2.54,0; 3 5.08,0; 4 7.62,0; 5 10.16,0
1X02 = drill 1.016 pad 1.88: 1 0,0; 2 2.54,0
WQP_PJ_301M6 = drill 1.016 pad 1.778 octagon: P1 0,-5.715; P2 0,-3.175; P3 0,4.445 | hole 2.2: 0,0
2X08 = drill 1.016 octagon: 1 -8.89,-1.27; 2 -8.89,1.27; 3 -6.35,-1.27; 4 -6.35,1.27; 5 -3.81,-1.27; 6 -3.81,1.27; 7 -1.27,-1.27; 8 -1.27,1.27; 9 1.27,-1.27; 10 1.27,1.27; 11 3.81,-1.27; 12 3.81,1.27; 13 6.35,-1.27; 14 6.35,1.27; 15 8.89,-1.27; 16 8.89,1.27
1X03 = drill 1.016 long: 1 -2.54,0; 2 0,0; 3 2.54,0
SMT-JUMPER_3_1-NC_TRACE_SILK = smd 0.635 x 1.27: 1 -1.016,0; 2 0,0; 3 1.016,0
0603 = smd 0.85 x 0.7: 1 -0.9,0; 2 0.7,0
PTC-1206 = smd 1 x 1.8: 1 -1.4,0; 2 1.4,0
ALPS_POT_VERTICAL_PS = drill 1 pad 1.88 square: P$1 -2.5,7; P$2 0,7; P$3 2.5,7 | drill 1.5 pad 2.54 octagon: P$4 -4.7,0; P$5 4.7,0
SOT23-BEC = smd 1 x 1.4: B -0.95,-1.1; C 0,1.1; E 0.95,-1.1
R1206 = smd 1.6 x 1.803: 1 -1.422,0; 2 1.422,0
0204/7 = drill 0.813 octagon: 1 -3.81,0; 2 3.81,0
R0603 = smd 1 x 1.1: 1 -0.85,0; 2 0.85,0
PEC11R-4215F-S0024 = drill 1 square: 1 -2.5,7 | drill 1: 2 2.5,7; A -2.5,-7.5; B 2.5,-7.5; C 0,-7.5 | drill 1.8 long: P1 -5.7,0; P2 5.7,0
D6R = drill 1.1 pad 1.93: A1 -2.5,2.5; A2 2.5,2.5; B1 -2.5,-2.5; B2 2.5,-2.5
TENNSY41-E = drill 1: 0-RX1/CS1/CRX2 -27.94,-7.62; 1-TX1/MISO1/CTX2 -25.4,-7.62; 2-OUT2 -22.86,-7.62; 3-LRCLK2 -20.32,-7.62; 4-BCLK2 -17.78,-7.62; 5-IN2 -15.24,-7.62; 6-OUT1D -12.7,-7.62; 7-RX2/OUT1A -10.16,-7.62; 8-TX2/IN1 -7.62,-7.62; 9-OUT1C -5.08,-7.62; 10-CS\MQSR -2.54,-7.62; 11-MOSI/CTX1 0,-7.62; 12-MISO/MQSL 2.54,-7.62; 13-SCK/LED 2.54,7.62; 14-A0/TX3/SPDIF_OUT 0,7.62; 15-A1/RX3/SPDIF_IN -2.54,7.62; 16-A2/RX4/SCL1 -5.08,7.62; 17-A3/TX4/SDA1 -7.62,7.62; 18-A4/SDA0 -10.16,7.62; 19-A5/SCL0 -12.7,7.62; 20-A6/TX5/LRCLK1 -15.24,7.62; 21-A7/RX5/BCLK1 -17.78,7.62; 22-A8/CTX1 -20.32,7.62; 23-A9/CRX1/MCLK1 -22.86,7.62; 24-A10/TX6/SCL2 7.62,-7.62; 25-A11/RX6/SDA2 10.16,-7.62; 26-A12/MOSI1 12.7,-7.62; 27-A13/SCK1 15.24,-7.62; 28-RX7 17.78,-7.62; 29-TX7 20.32,-7.62; 30-CRX3 22.86,-7.62; 31-CTX3 25.4,-7.62; 32-OUT1B 27.94,-7.62; 33-MCLK2 27.94,7.62; 34-RX8 25.4,7.62; 35-TX8 22.86,7.62; 36-PWM 20.32,7.62; 37-PWM 17.78,7.62; 38-A14/CS/IN1 15.24,7.62; 39-A15/CS/OUT1A 12.7,7.62; 40-A16/CS1 10.16,7.62; 41-A17/MISO1 7.62,7.62; +5V -24.13,-4.62; DM -21.59,-4.62; DP -19.05,-4.62; GND4 -16.51,-4.62; GND5 -13.97,-4.62; ON/OFF 15.24,5.08; PROGRAM 15.24,2.54; VBAT 15.24,-5.08; VUSB -27.94,5.08 | drill 1 octagon: 3V3-1 5.08,-7.62; 3V3-2 15.24,-2.54; 3V3-3 -25.4,7.62 | drill 1 square: GND1 -30.48,-7.62; GND2 15.24,0; GND3 5.08,7.62; GND6 -27.94,7.62 | drill 1 pad 1.676: VIN -30.48,7.62
DISPLAY-OLED-128X64-I2C = drill 1 square: 1 -3.81,12.7 | drill 1: 2 -1.27,12.7; 3 1.27,12.7; 4 3.81,12.7 | hole 2: -10.414,11.557; 10.414,11.557; 10.414,-11.557; -10.414,-11.557
RK12L12C0A0G = drill 0.8 pad 1.3: A1 0,0; A2 2,0; A3 4,0; B1 -2,0; B2 -4,0; B3 6,0 | drill 2.9 pad 4.35: MH1 -4.5,11; MH2 6.5,11
F25D = smd 1.7 x 3.5: 1 -16.459,-6.045; 2 -13.716,-6.045; 3 -10.973,-6.045; 4 -8.23,-6.045; 5 -5.486,-6.045; 6 -2.743,-6.045; 7 0,-6.045; 8 2.743,-6.045; 9 5.486,-6.045; 10 8.23,-6.045; 11 10.973,-6.045; 12 13.716,-6.045; 13 16.459,-6.045 | smd 1.7 x 3.5 bottom: 14 -15.088,-6.045; 15 -12.344,-6.045; 16 -9.601,-6.045; 17 -6.858,-6.045; 18 -4.115,-6.045; 19 -1.372,-6.045; 20 1.372,-6.045; 21 4.115,-6.045; 22 6.858,-6.045; 23 9.601,-6.045; 24 12.344,-6.045; 25 15.088,-6.045
USB-A003 = smd 1.12 x 4: 1 -3.5,14; 2 -1,14; 3 1,14; 4 3.5,14 | hole 2.3: -6.57,10.28; 6.57,10.28

### Placement (x,y rotation side)
C1  124.46,3.81 0 bottom
C2  134.62,3.81 180 bottom
C3  24.13,38.1 270 bottom
C4  90.17,27.94 90 bottom
C11  15.24,24.13 270 bottom
C12  68.58,27.94 90 bottom
C13  33.02,74.93 0 top
C14  31.75,45.09 180 top
C15  81.28,63.5 180 top
C16  33.02,68.58 0 top
C20  125.73,57.15 270 bottom
C21  113.03,3.81 180 bottom
C101  127,43.18 90 top
C104  107.95,21.59 90 top
C106  2.54,-7.62 0 top  (outside the outline)
C108  2.54,-2.54 0 top
C110  127,38.1 90 top
C201  129.54,25.4 90 top
C204  129.54,30.48 90 top
C210  107.95,26.67 90 top
D1  118.11,19.05 0 bottom
D2  104.14,16.51 0 bottom
D3  132.08,19.05 180 bottom
IC1  78.74,83.82 0 bottom
IC2  78.74,27.94 90 bottom
IC3  22.86,64.77 0 bottom
IC4  129.54,27.94 90 bottom
IC6  78.74,69.85 90 bottom
IC7  130.81,57.15 270 bottom
IC8  43.18,39.37 180 bottom
IC9  54.61,83.82 0 bottom
IC10  127,40.64 270 bottom
J1  100.33,60.96 0 top
J2  100.33,58.42 0 top
J_BLUE  31.75,12.7 0 top
J_GREEN  19.05,12.7 0 top
J_RED  6.35,12.7 0 top
JP1  121.92,11.43 180 bottom
JP2  135.13,40.89 90 top
JP3  132.08,48.26 180 bottom
JP4  127,48.26 0 bottom
L3  81.28,34.29 0 bottom
MOD_A  6.35,35.56 0 top
MOD_B  19.05,35.56 0 top
P1  123.19,19.05 270 bottom
P2  106.68,10.16 180 bottom
P3  127,19.05 270 bottom
P_BLUE  73.66,55.88 180 top
P_GREEN  55.88,55.88 180 top
P_MODA  44.45,76.2 180 top
P_MODB  66.04,76.2 180 top
P_RED  36.83,55.88 180 top
P_SAMPLE  55.88,35.56 180 top
P_X  44.45,97.79 180 top
P_Y  66.04,97.79 180 top
Q1  22.86,24.13 90 bottom
Q2  7.62,24.13 90 bottom
Q3  44.45,25.4 180 bottom
R7  69.85,35.56 180 bottom
R8  29.21,87.63 180 top
R9  29.21,83.82 180 top
R10  29.21,80.01 180 top
R11  22.86,74.93 180 top
R12  24.13,43.18 270 bottom
R13  33.02,72.39 180 top
R14  22.86,71.12 180 top
R16  139.7,43.18 180 bottom
R18  139.7,33.02 0 top
R19  139.7,35.56 0 top
R20  139.7,38.1 0 top
R21  139.7,46.99 0 top
R22  96.52,59.69 0 bottom
R23  115.57,73.66 180 top
R24  139.7,46.23 0 bottom
R25  137.16,57.15 90 bottom
R26  97.79,22.86 90 bottom
R27  101.6,22.86 270 bottom
R28  114.05,30.48 180 bottom
R29  119.38,30.48 180 bottom
R30  119.38,22.86 180 bottom
R31  119.38,26.67 180 bottom
R32  127,34.29 180 bottom
R33  123.19,33.02 90 bottom
R35  139.7,49.53 0 bottom
R36  31.75,39.37 180 top
R37  31.75,41.91 0 top
R38  31.75,36.83 0 top
R39  31.75,34.29 180 top
R40  31.75,29.21 180 top
R41  31.75,31.75 0 top
R42  2.54,24.13 90 bottom
R43  11.43,26.67 180 bottom
R44  24.13,20.32 180 bottom
R45  49.53,25.4 270 bottom
R46  39.37,25.4 90 bottom
R47  45.72,19.05 180 bottom
SW7  129.54,95.25 0 top
SW_BLANK  73.66,12.7 0 top
SW_DOWN  104.14,36.83 0 top
SW_LEFT  93.98,44.45 0 top
SW_PLAY  55.88,12.7 0 top
SW_RECORD  91.44,12.7 0 top
SW_RIGHT  114.3,44.45 0 top
SW_UP  104.14,52.07 0 top
U1  107.95,24.13 90 bottom
U$2  119.38,72.39 180 bottom
U$3  104.14,93.98 0 top
VR1  12.7,87.63 0 top
X1  152.15,33.27 270 top
X2  153.67,88.9 270 bottom
X_IN  6.35,55.88 0 top
Y_IN  19.05,55.88 0 top

### Tracks (layer width: path | path; a pad name or v marks a point on that pad's centre or on a via)
3.3V  (via drill 0.33)
  Top 0.356: v65.53,94.56 68.5,91.59 68.5,90.83 P_Y.P$1
  Bottom 0.356: 46.94,48.84 51.05,48.84 52.35,47.55 57.07,47.55 | 46.94,48.84 39.4,48.84 P_RED.P$1 | 57.07,47.55 58.37,48.84 P_GREEN.P$1 | 46.94,48.84 P_MODA.P$1 | 58.37,37.19 58.37,46.18 57.15,47.4 57.07,47.55 | 58.37,37.19 58.37,28.57 P_SAMPLE.P$1 | v65.53,94.56 53.72,94.56 49.99,90.83 47.02,90.83 P_X.P$1 | P_Y.P$1 68.5,90.75 67.74,89.99 67.74,82.6 66.6,81.46 66.6,75.36 68.5,73.46 68.5,69.27 P_MODB.P$1 68.58,69.04 76.12,61.49 76.12,48.92 P_BLUE.P$1 76.05,48.77 76.05,37.95 72.31,34.21 70.26,34.21 70.03,34.44 70.03,36.2 69.04,37.19 58.37,37.19
+3V3  (via drill 0.33)
  Top 0.152: v76.81,24.69 v78.03,24.69
  Bottom 0.152: 82.14,30.33 82.14,28.8 81.31,27.96 IC2.3 | 82.14,30.33 82.14,34.29 L3.1 | 82.14,30.33 90.14,30.33 C4.+ | 82.14,30.33 IC2.3 | R43.2 13.56,26.67 15.24,24.99 C11.1 15.24,24.69 14.48,23.93 14.48,20.12 18.59,16 37.26,16 43.89,22.63 45.34,22.63 46.25,21.72 46.63,21.72 46.67,21.68 | 46.67,21.68 49.53,24.54 R45.2 49.53,24.46 50.22,23.77 69.34,23.77 70.26,24.69 v76.81,24.69 | 46.67,21.68 46.63,21.64 46.63,19.05 R47.2 | v78.03,24.69 81.23,27.89 IC2.3
+3V3_A  (via drill 0.33)  (2 unrouted)
  Top 0.152: v80.54,65.99 v81.38,66.83
  Bottom 0.152: 80.54,34.29 79.7,34.29 72.7,27.28 49.07,27.28 47.32,25.53 44.81,25.53 44.27,26.06 44.27,33.3 41.3,36.27 41.3,36.73 IC8.8 | v81.38,66.83 81.38,67.89 IC6.8 | 80.54,34.29 v80.54,65.99 | 80.54,34.29 L3.2
+5V  (via drill 0.33)  (3 unrouted)
  Top 0.305: v113.31,35.51 v113.31,34.14
  Bottom 0.305: 106.91,21.87 109.04,24 109.04,26.44 113.08,30.48 R28.1 113.31,30.56 v113.31,34.14 | 106.91,21.87 106.15,21.11 100.89,21.11 100.05,21.95 97.84,21.95 R26.1 | C2.+ 137.01,3.81 137.01,12.27 130.3,18.97 D3.C 128.4,19.05 127.02,20.42 P3.1 126.87,20.5 126.04,21.34 115.82,21.34 114.53,20.04 108.74,20.04 106.91,21.87 | 124.82,47.93 124.82,57.07 125.73,57.99 C20.1 | 124.82,47.93 125.5,47.24 133.58,47.24 133.81,47.47 133.81,51.66 132.13,53.34 132.13,54.18 IC7.9 132.06,54.33 132.06,55.4 131.75,55.7 | 131.75,55.7 128.85,58.6 128.85,60.05 IC7.1 | U$3.2 103.78,106.68 107.06,103.4 132.74,103.4 145.92,90.22 145.92,79.32 143.41,76.81 143.41,64.31 142.26,63.17 139.22,63.17 131.75,55.7 | v113.31,35.51 113.31,36.42 124.82,47.93
+12V  (via drill 0.33)
  Top 0.305: 127.86,40.62 127.18,41.3 127.18,42.14 127.02,42.29 C101.1 | 127.86,40.62 128.32,40.16 128.32,37.8 127.79,37.26 127.02,37.26 C110.1 126.87,37.19 126.87,34.59 124.28,32 v124.28,31.39 124.21,31.32 124.21,30.48 v119.33,25.6 | v127.94,40.69 127.86,40.62 | C104.1 107.98,20.8 v109.04,20.8 v110.57,19.28
  Bottom 0.305: v124.28,31.39 124.28,29.95 126.26,27.96 126.87,27.96 IC4.4 | v127.94,40.69 129.54,40.69 IC10.4 | v109.04,20.8 110.49,22.25 U1.8 110.64,22.33 113.08,22.33 116.36,25.6 v119.33,25.6 | D1.C 121.77,19.05 123.14,20.42 P1.1 | C1.+ 122,3.81 122,7.16 119.48,9.68 119.48,18.52 119.94,18.97 D1.C | v110.57,19.28 114.53,19.28 115.37,20.12 117.88,20.12 119.4,18.59 D1.C
-12V  (via drill 0.33)
  Top 0.305: 129.54,27.43 C201.2 | 128.25,28.73 129.54,27.43 | 128.25,28.73 128.25,30.79 128.7,31.24 129.46,31.24 129.54,31.32 C204.2 129.46,31.39 129.46,32.23 v129.24,32.46 | v129.62,27.51 129.54,27.43 | v106.83,27.51 107.9,27.51 C210.2 108.05,27.43 108.13,27.36 108.89,27.36 111.4,24.84 119.56,24.84 123.37,28.65 128.17,28.65 128.25,28.73
  Bottom 0.305: v129.62,27.51 130,27.89 132.13,27.89 IC4.11 | v129.24,32.46 129.24,34.75 128.09,35.89 128.09,37.64 125.12,40.62 124.43,40.62 IC10.11 | v106.83,27.51 105.39,26.06 U1.4 105.23,25.98 98.45,25.98 96.85,24.38 96.85,21.34 101.65,16.54 102.11,16.54 D2.A 102.26,16.46 102.26,13.18 105.23,10.21 P2.1 105.39,10.06 110.57,4.88 110.57,3.81 C21.-
AREF_3V3
  Bottom 0.152: IC7.11 130.76,54.18 130.76,53.49 130.53,53.26 129.85,53.26 129.54,53.57 129.54,54.18 IC7.13 129.46,54.25 129.46,57.3 125.5,61.27 125.5,79.02 124.51,80.01 U$2.3V3-1
AREF_-10
  Top 0.356: R41.2 35.51,31.77 35.51,31.93 34.29,33.15 34.29,35.66 35.51,36.88 R38.2
  Bottom 0.356: MOD_A.P2 MOD_B.P2 19.2,32.46 27.28,32.46 28.12,33.3 28.35,33.3 28.88,33.83 28.88,35.89 | 27.51,38.41 26.98,38.94 24.16,38.94 C3.1 | 27.51,38.41 28.35,38.41 28.88,38.94 28.88,39.78 27.74,40.92 25.53,40.92 24.16,42.29 R12.2 24,42.44 24,42.6 17.83,48.77 17.83,52.73 | 28.88,35.89 34.59,35.89 35.51,36.8 R38.2 | 28.88,35.89 27.51,35.89 26.98,36.42 26.98,37.26 27.43,37.72 27.43,38.25 27.51,38.41 | 17.83,52.73 19.05,52.73 Y_IN.P2 19.13,52.88 19.13,53.57 21.79,56.24 21.79,63.55 IC3.2 21.87,63.7 21.87,68.28 19.05,71.09 R14.2 19.13,71.25 25.38,77.5 25.38,80.01 R10.2 | 17.83,52.73 6.4,52.73 X_IN.P2
B1+1  (via drill 0.33)
  Top 0.152: v127.64,35.36 129.92,33.07 138.84,33.07 R18.1
  Bottom 0.152: v127.64,35.36 126.95,35.36 125.5,36.8 124.43,36.8 IC10.8 124.43,36.88 124.43,38.1 IC10.9
B+
  Top 0.152: R18.2 140.59,33.07 145.92,33.07 146.07,33.22 X1.7
ENC_A
  Bottom 0.152: U$2.40-A16/CS1 128.55,63.78 126.57,63.78 125.96,64.39 125.96,80.39 127.02,81.46 127.02,87.71 SW7.A
ENC_B
  Bottom 0.152: U$2.41-A17/MISO1 127.02,64.77 127.02,76.05 131.06,80.09 131.06,86.79 131.98,87.71 SW7.B
G1+  (via drill 0.33)
  Top 0.152: v132.74,35.89 133.05,35.59 138.84,35.59 R19.1
  Bottom 0.152: v132.74,35.89 130.53,35.89 129.62,36.8 IC10.7 129.62,36.88 129.62,38.1 IC10.6
G+
  Top 0.152: R19.2 140.59,35.59 145.69,35.59 146.07,35.97 X1.6
GND  (via drill 0.33)  (60 unrouted)
  Bottom 0.152: X1.18 146.15,37.34 146.15,34.67 X1.19 146.15,34.59 146.15,31.93 X1.20 146.07,31.85 145.85,31.85 144.09,30.1 144.09,19.05 | 144.09,19.05 145.24,19.05 X1.25 | 144.09,19.05 v139.68,19.05 D3.A | 74.3,73.3 74.3,72.47 74.98,71.78 76.12,71.78 IC6.4 76.12,71.7 76.12,70.48 IC6.3 | 74.3,73.3 v74.3,76.58 | 74.3,73.3 77.95,73.3 79.48,71.78 81.31,71.78 IC6.5 | C2.- C1.- 126.8,3.81 126.8,4.04 120.7,10.13 JP1.8 | IC2.1 73.91,25.6 v71.25,25.6 68.58,25.6 C12.- | IC8.3 43.81,41.99 45.03,41.99 IC8.4 45.11,41.91 45.11,36.8 IC8.5 45.11,36.73 45.11,26.9 45.42,26.59 Q3.E 45.42,26.52 47.85,26.52 49.83,28.5 53.34,28.5 P_SAMPLE.P$3 | C11.2 15.24,23.32 19.96,23.32 21.72,25.07 Q1.E 21.72,25.15 21.72,27.13 19.05,29.79 MOD_B.P1 | IC3.1 23.77,63.63 23.77,54.94 19.05,50.22 Y_IN.P1 | v25.15,37.26 24.16,37.26 C3.2 | R22.1 97.38,59.66 97.38,53.8 101.58,49.61 SW_UP.B1 | v125.73,55.24 C20.2 | v137.16,55.24 R25.1 | MOD_A.P1 6.48,29.72 6.48,25.15 Q2.E | 112.7,15.54 115.52,12.72 JP1.3 | 112.7,15.54 111.79,16.46 106.07,16.46 D2.C | 112.7,15.54 D1.A | 50.14,80.7 50.14,79.78 41.99,71.63 41.99,69.27 P_MODA.P$3 | v125.27,26.67 IC4.3 | v133.81,29.18 132.21,29.18 IC4.10 | v122.76,41.91 IC10.12 | C4.- 90.22,25.6 92.89,25.6 101.58,34.29 SW_DOWN.B1 | C21.+ 115.44,3.81 115.44,10.06 115.52,10.13 JP1.4
  pour Top: 1.27,107.95 143.51,107.95 144.78,106.68 144.78,1.27 2.54,1.27 1.27,0
INH1  (via drill 0.33)
  Top 0.152: v57.15,82.68 73.53,82.68 v80.01,89.15
  Bottom 0.152: v57.15,82.68 54.18,82.68 52.73,81.23 52.73,80.77 IC9.6 | v80.01,89.15 104.17,89.15 107.29,92.28 136.17,92.28 137.39,93.5 141.96,93.5 145.01,90.45 145.01,80.24 U$2.31-CTX3
INH2  (via drill 0.33)
  Top 0.152: v82.68,84.28 v80.7,82.3 | v126.42,81.69 135.18,81.69 136.86,80.01 U$2.28-RX7
  Bottom 0.152: v80.7,82.3 77.95,82.3 76.89,81.23 76.89,80.77 IC1.6 | v82.68,84.28 90.98,75.97 119.48,75.97 123.44,79.93 123.44,80.39 124.74,81.69 v126.42,81.69
INTERLOCK
  Top 0.152: JP2.3 135.64,43.43 138.45,40.62 143.71,40.62 144.55,41.45 146.07,41.45 X1.4
INTERLOCK2
  Bottom 0.152: JP2.2 135.18,40.92 137.69,40.92 138.61,41.83 144.17,41.83 145.85,40.16 146.07,40.16 X1.17
MOD_A  (1 unrouted)
  Bottom 0.152: IC8.1 41.22,41.99 38.63,41.99 34.67,45.95 30.1,45.95 29.26,45.11 C14.2 29.19,45.03 27.97,43.81 27.97,41.91 R37.1
MOD_B  (via drill 0.33)  (1 unrouted)
  Top 0.152: v37.8,46.38 37.8,41.07 v40.46,38.41
  Bottom 0.152: 40.8,38.06 36.42,33.68 36.42,30.1 35.59,29.26 R40.1 | 40.8,38.06 40.84,38.1 41.68,38.1 42.52,37.26 42.52,36.8 IC8.7 | v37.8,46.38 37.06,46.38 35.66,47.78 35.66,49.99 36.2,50.52 36.2,55.55 35.59,56.16 35.59,68.58 C16.2 | 40.8,38.06 v40.46,38.41
MOSI  (1 unrouted)
MUXA  (1 unrouted)
  Bottom 0.152: IC9.11 52.73,86.94 52.73,88.62 57.15,93.04 71.6,93.04 76.81,87.83 76.81,86.94 IC1.11
MUXB  (via drill 0.33)
  Top 0.152: v53.34,88.39 v52.12,88.39 | U$2.34-RX8 144.78,65.3 145.77,66.29 145.77,106.15 143.64,108.28 86.64,108.28 v70.79,92.43
  Bottom 0.152: IC9.10 51.44,87.71 v52.12,88.39 | v53.34,88.39 56.69,88.39 60.58,92.28 70.64,92.28 | 70.64,92.28 71.14,92.28 75.51,87.91 75.51,86.94 IC1.10 | 70.64,92.28 v70.79,92.43
MUXC  (via drill 0.33)
  Top 0.152: v80.09,82.91 v82.53,85.34
  Bottom 0.152: 77.56,85.43 77.27,85.14 75.26,85.14 74.3,86.11 IC1.9 | IC9.9 50.22,86.94 50.22,90.45 53.72,93.95 71.86,93.95 77.42,88.39 77.42,85.57 77.56,85.43 | v82.53,85.34 105.84,85.34 112.47,91.97 136.32,91.97 137.54,93.19 141.81,93.19 141.96,93.04 141.96,84.73 141.2,83.97 141.2,79.63 142.19,78.64 142.19,64.77 U$2.35-TX8 | 77.56,85.43 v80.09,82.91
N$1
  Bottom 0.152: JP4.1 128.02,53.34 128.85,54.18 IC7.14
N$2
  Bottom 0.152: JP3.1 131.06,53.19 131.44,53.57 131.44,54.18 IC7.10
N$3
  Bottom 0.152: U$2.+5V 95.25,77.04 97.92,79.7 97.92,80.47 102.49,85.04 108.81,85.04 113.46,89.69 126.04,89.69 128.02,91.67 138.91,91.67 139.6,92.35 X2.1
N$4
  Bottom 0.152: U$2.DM 97.84,77.04 97.84,77.19 100.43,79.78 100.43,80.47 104.39,84.43 121.23,84.43 126.42,89.61 139.37,89.61 139.6,89.84 X2.2
N$5
  Bottom 0.152: U$2.DP 100.36,77.04 103.02,79.7 103.02,80.54 106.6,84.12 121.39,84.12 126.34,89.08 138.45,89.08 139.6,87.94 X2.3
N$6  (via drill 0.33)
  Top 0.152: v68.12,75.67 66.83,74.37 59.13,74.37 v50.83,82.68
  Bottom 0.152: C15.1 83.82,63.55 80.77,66.6 80.09,66.6 77.5,69.19 76.2,69.19 IC6.2 76.12,69.27 74.52,69.27 v68.12,75.67 | 32.96,82.64 32.16,83.44 32.16,83.82 | 32.96,82.64 32.99,82.6 32.99,80.01 R10.1 | 32.16,83.82 32.16,86.79 32.99,87.63 R8.1 | 32.16,83.82 R9.2 | v50.83,82.68 32.99,82.68 32.96,82.64
N$7
  Bottom 0.152: P2.2 108.13,10.21 113.01,10.21 JP1.2 113.01,10.29 113.01,12.65 JP1.1
N$8
  Bottom 0.152: P1.2 123.21,17.6 123.21,12.72 JP1.9 123.21,12.65 123.21,10.21 JP1.10
N$9
  Bottom 0.152: VR1.B2 8.69,87.63 8.69,62.64 6.4,60.35 X_IN.P3
N$10
  Bottom 0.152: P3.2 126.95,17.6 126.95,13.95 125.73,12.72 JP1.11 JP1.12
N$11  (via drill 0.33)
  Top 0.152: v74.91,72.69 73.84,73.76 31.7,73.76 30.48,74.98 C13.1
  Bottom 0.152: 26.67,71.17 27.97,71.17 29.19,72.39 R13.2 29.26,72.39 29.26,73.69 30.48,74.91 C13.1 | 26.67,71.17 R11.1 | 26.67,71.17 R14.1 | IC6.6 79.43,70.48 77.22,72.69 v74.91,72.69
N$12
  Bottom 0.152: U$2.GND4 102.87,77.04 104.01,77.04 105.84,78.87 117.35,78.87 118.26,79.78 118.26,80.54 126.49,88.77 135.87,88.77 139.22,85.42 139.6,85.42 X2.4
N$13
  Bottom 0.152: IC10.13 124.43,43.2 124.43,44.42 IC10.14
N$14
  Bottom 0.152: 35.59,39.4 40.46,39.4 42.52,41.45 42.52,41.91 IC8.2 | R38.1 27.97,36.88 33.07,36.88 R36.1 35.59,39.4 | 35.59,39.4 35.59,41.91 R37.2 35.51,41.91 34.29,43.13 C14.1
N$15
  Bottom 0.152: VR1.B3 R8.2
N$16
  Bottom 0.152: IC2.2 73.91,30.25 68.66,30.25 68.58,30.33 C12.+ 68.58,30.4 68.5,30.48 68.5,35.51 R7.1
N$17  (1 unrouted)
N$18  (1 unrouted)
N$22
  Bottom 0.152: IC9.13 55.25,86.26 50.98,81.99 49.68,81.99 36.8,69.11 36.8,48.92 P_RED.P$2
N$24
  Bottom 0.152: IC9.14 56.54,86.94 56.54,87.78 60.73,91.97 67.13,91.97 67.28,91.82 67.28,82.75 66.14,81.61 66.14,71.32 67.36,70.1 67.36,55.17 73.61,48.92 P_BLUE.P$2
N$25
  Bottom 0.152: VR1.A2 14.71,64.69 19.05,60.35 Y_IN.P3
N$26
  Bottom 0.152: IC1.1 83.21,80.7 83.21,78.87 85.88,76.2 85.88,69.88 90.3,65.46 90.3,64.08 93.57,60.81 98.15,60.81 99.14,59.82 99.14,57.91 100.97,56.08 107.67,56.08 116.74,47.02 SW_RIGHT.A2
N$27
  Bottom 0.152: IC9.15 57.76,86.87 57.76,82.45 57.07,81.76 57.07,79.48 55.93,78.33 55.93,48.92 P_GREEN.P$2
N$28  (via drill 0.33)
  Top 0.152: v84.89,69.11 v86.79,71.02
  Bottom 0.152: IC1.15 81.92,84.2 86.79,79.32 v86.79,71.02 | v84.89,69.11 84.89,38.1 81.31,34.52 81.31,33.91 78.33,30.94 78.11,30.94 77.42,30.25 77.42,16.46 SW_BLANK.A2
N$29
  Bottom 0.152: IC9.12 53.95,86.87 53.95,86.41 53.19,85.65 49.61,85.65 44.5,90.75 P_X.P$2
N$30
  Bottom 0.152: R26.2 97.84,23.77 101.58,23.77 R27.1 101.65,23.7 101.8,23.55 105.31,23.55 U1.2
N$31
  Bottom 0.152: R29.1 R28.2 114.83,30.48 114.83,28.57 111.02,24.77 U1.6
N$32
  Bottom 0.152: IC9.1 59.06,80.77 61.11,80.77 66.98,86.64 66.98,89.84 66.06,90.75 P_Y.P$2
N$34
  Bottom 0.152: R40.2 27.97,29.26 27.97,31.7 R41.1 28.04,31.7 32.92,31.7 35.51,34.29 | IC8.6 43.81,37.26 42.1,38.98 | 42.1,38.98 42.06,39.01 40.23,39.01 35.51,34.29 | C16.1 30.48,60.81 35.89,55.4 35.89,52.65 33.15,49.91 33.15,47.85 34.75,46.25 36.58,46.25 39.47,43.36 42.9,43.36 43.13,43.13 43.13,40.01 42.1,38.98 | 35.51,34.29 R39.1
N$35
  Bottom 0.152: R33.2 123.21,33.91 125.73,33.91 126.11,34.29 R32.1 126.19,34.29 130,30.48 IC4.9
N$36
  Bottom 0.152: 120.13,25.49 120.17,25.53 120.17,26.67 R31.2 | 120.13,25.49 118.57,23.93 118.57,22.86 R30.1 | IC4.2 126.87,25.45 120.17,25.45 120.13,25.49
N$38  (via drill 0.33)
  Top 0.152: v82.07,78.72 v82.07,82.6 | v91.44,29.49 91.44,18.21 93.88,15.77 93.88,15.24 SW_RECORD.A2
  Bottom 0.152: v82.07,82.6 80.7,83.97 80.7,86.87 IC1.14 | v82.07,78.72 82.07,72.77 87.48,67.36 87.48,35.59 91.44,31.62 v91.44,29.49
N$39
  Bottom 0.152: IC1.13 79.4,86.94 79.4,89.38 91.29,101.27 131.06,101.27 131.98,102.18 SW7.2
N$40
  Bottom 0.152: IC9.5 53.95,80.7 53.95,78.87 44.5,69.42 44.5,69.27 P_MODA.P$2
N$41
  Bottom 0.152: IC9.2 57.84,80.7 57.84,79.63 59.82,77.65 59.82,75.44 65.99,69.27 P_MODB.P$2
N$42
  Bottom 0.152: IC9.4 55.25,79.7 45.64,70.1 45.64,57.45 38.1,49.91 38.1,47.85 42.29,43.66 45.26,43.66 55.86,33.07 55.86,28.57 P_SAMPLE.P$2
N$43
  Bottom 0.152: R11.2 19.05,85.34 16.76,87.63 VR1.A3
N$44
  Bottom 0.152: R42.1 2.59,23.24 2.59,20.88 6.32,17.14 J_RED.P3
N$45
  Bottom 0.152: R36.2 27.89,39.4 25.07,39.4 23.32,41.15 7.54,41.15 6.4,40.01 MOD_A.P3
N$46
  Bottom 0.152: R39.2 24.77,34.29 MOD_B.P3
N$48
  Bottom 0.152: R44.2 24.92,20.34 24.69,20.34 21.79,23.24 Q1.B
N$49
  Bottom 0.152: J_GREEN.P3 22.17,20.27 23.24,20.27 R44.1
N$51
  Bottom 0.152: R46.2 39.4,26.29 43.28,26.29 43.43,26.44 Q3.B
N$52
  Bottom 0.152: R46.1 39.32,24.54 39.17,24.54 31.77,17.14 J_BLUE.P3
N$66
  Bottom 0.152: R42.2 2.59,24.92 4.8,24.92 6.48,23.24 Q2.B
OUTL  (1 unrouted)
OUTR  (1 unrouted)
R1+  (via drill 0.33)
  Top 0.152: R20.1 137.54,38.1 136.47,37.03 133.81,37.03 v132.44,38.41
  Bottom 0.152: v132.44,38.41 132.44,39.62 130.68,41.38 128.4,41.38 128.25,41.53 128.25,42.29 129.08,43.13 129.54,43.13 IC10.2 129.62,43.2 129.62,44.42 IC10.1
R+
  Top 0.152: R20.2 143.94,38.1 144.55,38.71 146.07,38.71 X1.5
SCK  (1 unrouted)
SCL  (1 unrouted)
SDA  (1 unrouted)
SS  (1 unrouted)
T26  (via drill 0.33)
  Top 0.152: v126.87,60.73 v123.52,57.38
  Bottom 0.152: 9.33,24.73 8.76,24.16 Q2.C | 9.33,24.73 10.52,25.91 10.52,26.67 R43.1 | 9.33,24.73 19.74,14.33 47.7,14.33 48.69,13.34 83.9,13.34 109.35,38.79 111.71,38.79 123.52,50.6 v123.52,57.38 | v126.87,60.73 129.92,63.78 130,63.78 131.06,64.85 131.06,79.02 132.06,80.01 U$2.26-A12/MOSI1
T27  (via drill 0.33)
  Top 0.152: v43.51,25.3 45.11,25.3 v45.49,24.92 45.42,24.92 44.12,23.62 v44.12,22.02 | U$2.27-A13/SCK1 134.34,80.01 133.73,79.4 133.58,79.4 120.4,66.22 v118.72,66.22
  Bottom 0.152: v45.49,24.92 47.17,24.92 48.46,26.21 49.53,26.21 R45.1 | v43.51,25.3 25.15,25.3 24,24.16 Q1.C | v118.72,66.22 118.72,65.76 118.03,65.08 118.03,45.57 111.56,39.09 108.13,39.09 82.68,13.64 48.84,13.64 44.12,18.36 v44.12,22.02
T38  (via drill 0.33)
  Top 0.152: v46.48,22.33 53.34,15.47 53.34,15.24 SW_PLAY.A1 | U$2.38-A14/CS/IN1 134.34,64.77 133.73,64.16 133.58,64.16 117.96,48.54 v116.36,48.54 116.2,48.54 107.06,39.4 106.68,39.4 SW_DOWN.A2
  Bottom 0.152: R47.1 45.19,19.05 49,15.24 53.34,15.24 SW_PLAY.A1 53.42,15.24 58.37,15.24 SW_PLAY.A2 58.45,15.16 69.49,15.16 70.71,13.95 76.66,13.95 89.23,26.52 89.23,27.13 90.68,28.57 91.36,28.57 101.58,38.79 101.58,39.32 SW_DOWN.A1 106.6,39.32 SW_DOWN.A2 | v46.48,22.33 46.41,22.33 44.5,24.23 Q3.C | IC1.2 81.92,81.92 81.88,81.95 | 81.88,81.95 78.11,85.72 IC1.12 | v116.36,48.54 116.36,49.07 105.84,59.59 99.97,59.59 95.4,64.16 95.4,65 94.49,65.91 91.06,65.91 86.18,70.79 86.18,79.48 83.67,81.99 81.92,81.99 81.88,81.95
T39
  Top 0.152: U$2.39-A15/CS/OUT1A 131.75,64.77 114.45,47.47 113.16,47.47 112.7,47.02 111.86,47.02 SW_RIGHT.A1
  Bottom 0.152: SW_UP.A1 101.65,54.56 106.6,54.56 SW_UP.A2 106.6,54.48 106.6,52.2 106.64,52.16 | 106.64,52.16 111.79,47.02 SW_RIGHT.A1 | IC1.5 78.11,80.77 79.32,80.77 IC1.4 79.4,80.7 79.4,79.55 79.63,79.32 82.3,79.32 85.57,76.05 85.57,69.72 87.78,67.51 87.78,50.67 91.44,47.02 SW_LEFT.A1 91.52,46.94 96.47,46.94 SW_LEFT.A2 96.55,47.02 100.81,47.02 105.92,52.12 106.6,52.12 106.64,52.16
TB  (via drill 0.33)  (1 unrouted)
  Top 0.152: v119.94,42.06 v116.82,45.19
  Bottom 0.152: v116.82,45.19 115.6,46.41 115.6,47.32 107.14,55.78 100.81,55.78 98.83,57.76 98.83,59.66 97.99,60.5 96.77,60.5 96.01,59.74 95.71,59.74 R22.2 | v119.94,42.06 121.16,42.06 123.83,39.4 124.36,39.4 IC10.10
TG  (via drill 0.33)  (1 unrouted)
  Top 0.152: v114.76,72.54 114.76,73.61 R23.2 | v124.82,46.94 v123.83,47.93
  Bottom 0.152: v114.76,72.54 114.76,71.02 120.78,65 120.78,61.04 124.13,57.68 124.13,48.23 v123.83,47.93 | v124.82,46.94 124.82,45.8 126.04,44.58 126.04,40.39 127.02,39.4 129.54,39.4 IC10.5
TR  (via drill 0.33)
  Top 0.152: v135.18,47.02 v133.96,45.8
  Bottom 0.152: U$2.32-OUT1B 147.3,80.01 146.3,79.02 146.3,64.85 144.17,62.71 139.52,62.71 137.16,60.35 R25.2 137.16,57.99 135.18,56.01 v135.18,47.02 | IC10.3 130.07,41.91 v133.96,45.8
VCC  (via drill 0.33)
  Top 0.457: v57.53,79.1 v59.89,81.46 60.05,81.61 73.3,81.61 v80.01,88.32
  Bottom 0.457: v57.53,79.1 57.53,56.54 71.25,42.82 71.25,35.59 R7.2 | v59.89,81.46 59.89,86.03 59.06,86.87 | 83.13,86.94 83.13,87.63 82.45,88.32 v80.01,88.32
VEE  (via drill 0.33)
  Top 0.152: v37.41,57.3 v35.28,55.17
  Bottom 0.152: v35.28,55.17 24.16,44.04 R12.1 | v37.41,57.3 37.41,62.41 43.28,68.28 43.28,72.47 50.29,79.48 50.6,79.48 51.44,80.31
X1+  (via drill 0.33)
  Top 0.152: v126.64,40.62 124.59,38.56 v124.59,33.3
  Bottom 0.152: R35.1 140.28,49.53 137.16,46.41 129.77,46.41 126.64,43.28 v126.64,40.62 | v124.59,33.3 125.35,33.3 126.87,31.77 IC4.7 126.95,31.7 IC4.6
X1-  (via drill 0.33)
  Top 0.152: v132.13,35.28 v132.13,36.5
  Bottom 0.152: R32.2 127.56,34.29 126.72,35.13 123.06,35.13 122.38,34.44 122.38,33.3 122.76,32.92 124.13,32.92 125.58,31.47 125.58,30.1 125.73,29.95 133.35,29.95 133.5,30.1 133.5,30.86 132.66,31.7 132.21,31.7 IC4.8 132.13,31.77 v132.13,35.28 | v132.13,36.5 133.05,37.41 133.05,41.45 133.81,42.22 136.25,42.22 140.21,46.18 140.51,46.18 R24.1
X2
  Bottom 0.152: R27.2 101.65,22.02 105.16,22.02 105.31,22.17 U1.1 105.39,22.25 105.84,22.25 108.58,24.99 108.58,30.33 113.08,34.82 120.4,34.82 122.99,32.23 123.14,32.23 R33.1 123.21,32.16 124.43,32.16 125.27,31.32 125.27,29.95 125.96,29.26 126.87,29.26 IC4.5
X+  (via drill 0.33)
  Top 0.152: v140.06,50.6 140.67,49.99 145.85,49.99 146.07,49.76 X1.1
  Bottom 0.152: v140.06,50.6 139.98,50.6 138.91,49.53 R35.2
X-
  Bottom 0.152: R24.2 138.91,46.25 139.14,46.25 141.2,48.31 146.07,48.31 X1.14
X_IN  (via drill 0.33)  (1 unrouted)
  Top 0.152: v51.97,83.82 57.76,78.03 64.92,78.03 v67.28,75.67 | C15.2 80.01,63.5 82.55,60.96 88.9,60.96 90.81,62.87 110.74,62.87
  Bottom 0.152: C15.2 78.72,63.55 76.2,66.06 76.2,67.89 IC6.1 76.12,67.97 74.98,67.97 v67.28,75.67 | v51.97,83.82 R9.1
Y1+  (via drill 0.33)
  Top 0.152: v138.84,41.22 138.84,46.94 R21.1
  Bottom 0.152: v138.84,41.22 138.84,31.17 133.12,25.45 132.21,25.45 IC4.13 132.13,25.38 132.13,24.16 IC4.14
Y1-
  Bottom 0.152: R30.2 125.65,22.86 126.87,24.08 IC4.1 126.95,24.16 127.48,24.16 129.31,25.98 133.2,25.98 134.42,27.2 134.42,31.24 133.35,32.31 133.35,41.3 133.96,41.91 136.4,41.91 137.62,43.13 138.84,43.13 R16.1
Y2
  Bottom 0.152: U1.7 110.57,23.55 113.61,23.55 116.74,26.67 R31.1 118.57,26.67 118.57,28.88 120.17,30.48 R29.2 120.24,30.48 123.37,27.36 128.02,27.36 128.7,26.67 IC4.12
Y+
  Top 0.152: R21.2 140.59,47.02 146.07,47.02 X1.2
Y-
  Bottom 0.152: R16.2 140.59,43.2 143.49,43.2 145.85,45.57 146.07,45.57 X1.15
Y_IN  (via drill 0.33, 0.35)
  Top 0.152: v71.48,73.15 70.71,72.39 R13.1 | U$2.16-A2/RX4/SCL1 113.03,66.04 83.82,66.04 v83.82,67.31
  Bottom 0.152: v71.48,73.15 74.8,69.83 78.97,69.83 79.53,69.27 81.31,69.27 IC6.7 82.68,69.22 83.31,68.58 83.31,67.82 v83.82,67.31 | C13.2 35.59,74.91 35.59,73.61 36.8,72.39 R13.1

### Text on the board
TallParts: ISP
ArduinoHoles: 3.2mm | 2.2mm | 3.2mm